# EAGLE design streams_v05 (EAGLE 7.7.0)

## Sheet 1 of 4
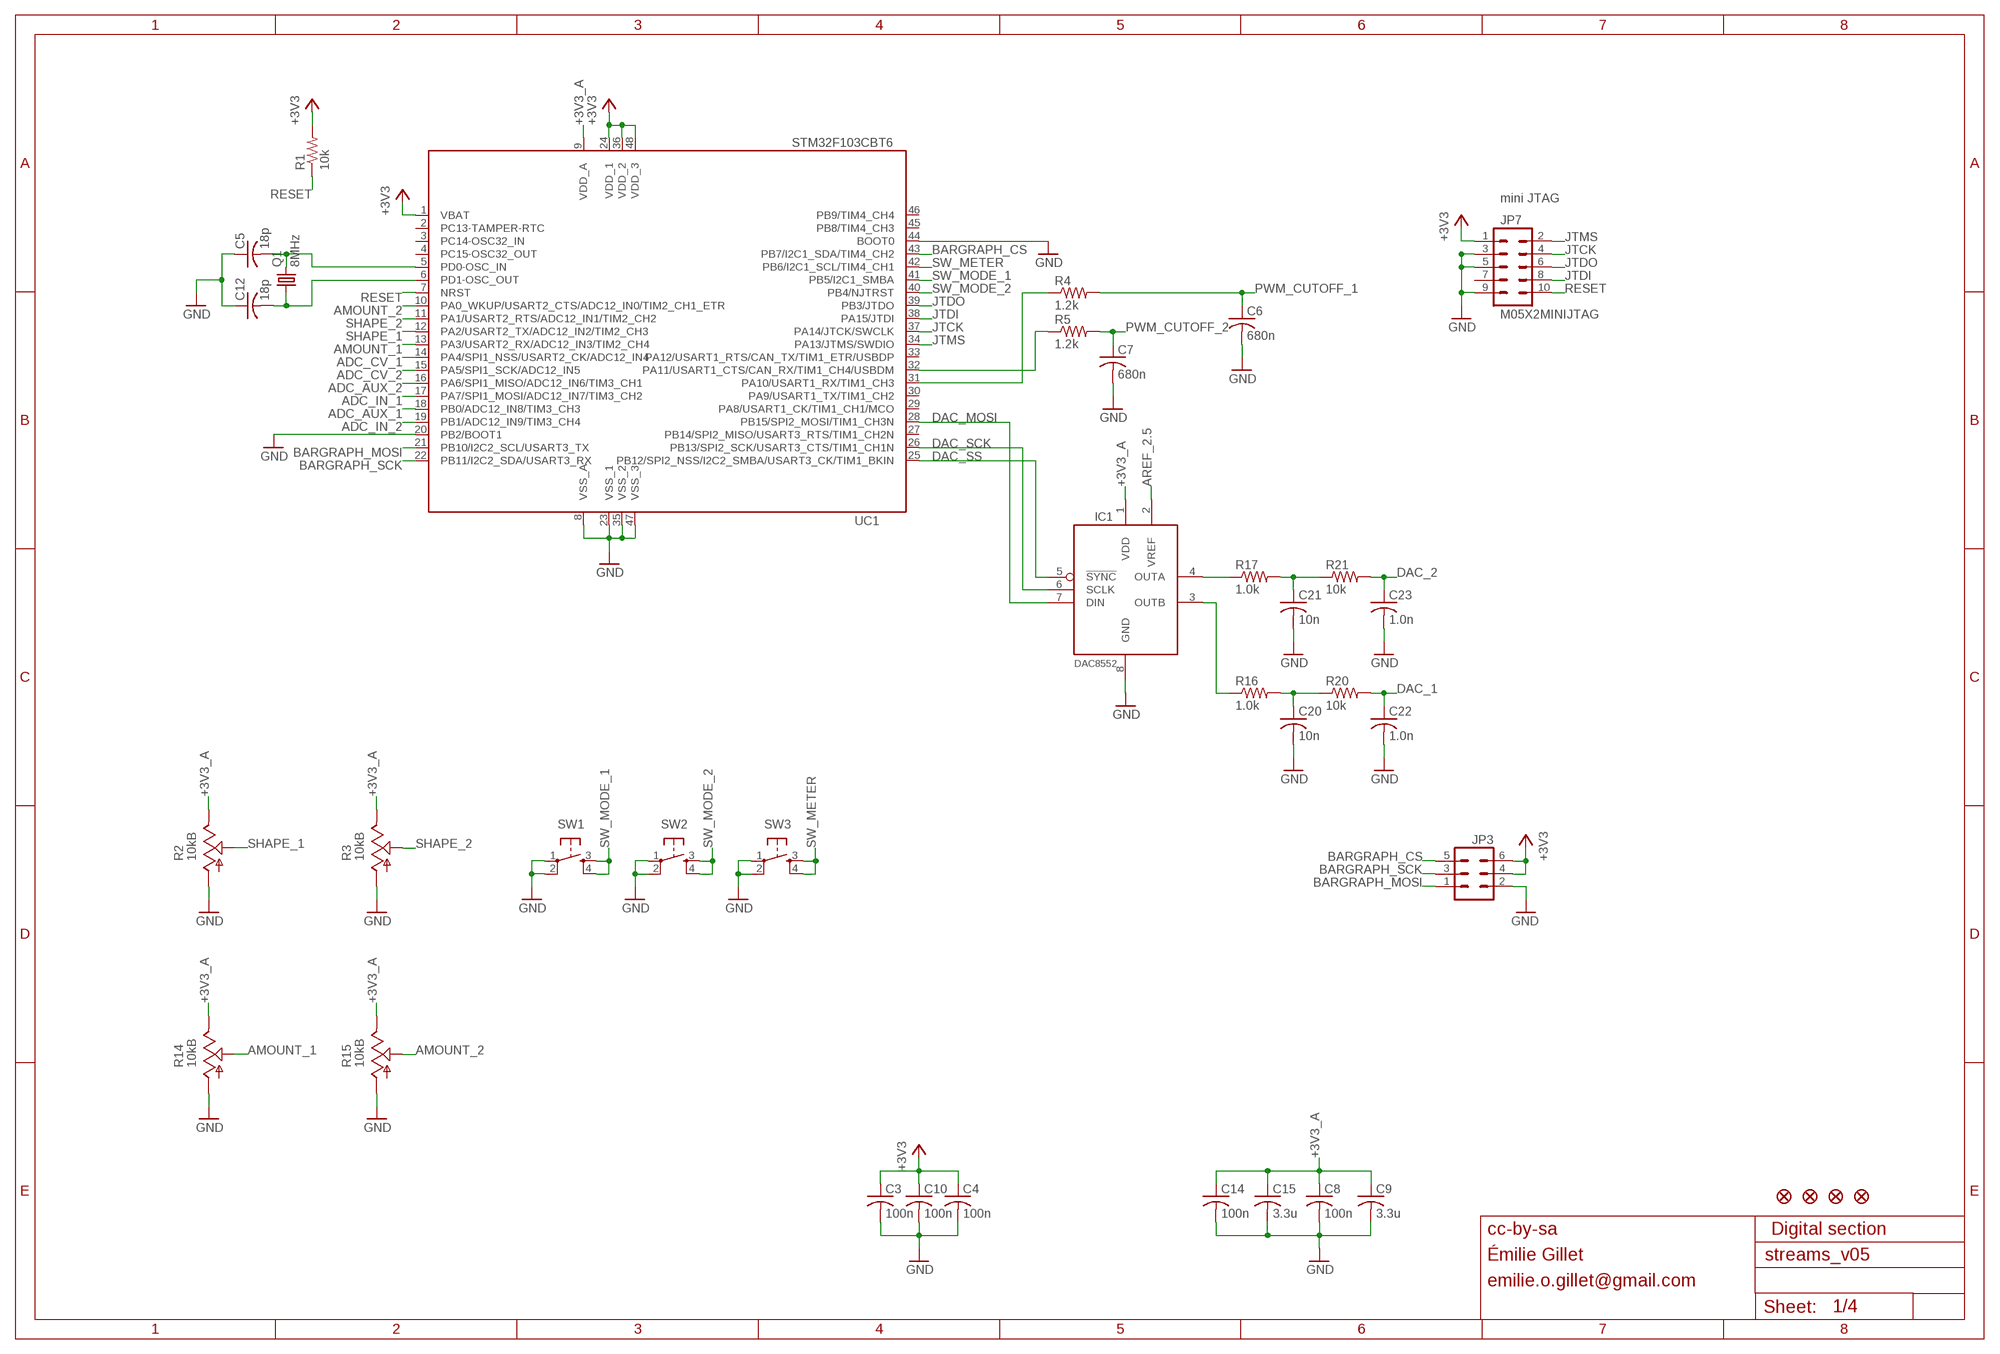
[diagram p0: schematic, sheet 1]

### Parts
C3  100n  C-USC0603  [C0603]
C4  100n  C-USC0603  [C0603]
C5  18p  C-USC0603  [C0603]
C6  680n  C-USC0603  [C0603]
C7  680n  C-USC0603  [C0603]
C8  100n  C-USC0603  [C0603]
C9  3.3u  C-USC0603  [C0603]
C10  100n  C-USC0603  [C0603]
C12  18p  C-USC0603  [C0603]
C14  100n  C-USC0603  [C0603]
C15  3.3u  C-USC0603  [C0603]
C20  10n  C-USC0603  [C0603]
C21  10n  C-USC0603  [C0603]
C22  1.0n  C-USC0603  [C0603]
C23  1.0n  C-USC0603  [C0603]
IC1  DAC8552  [MSOP-8]
JP1  FIDUCIAL1X2  [FIDUCIAL-1X2]
JP2  FIDUCIAL1X2  [FIDUCIAL-1X2]
JP3  M03X2BOTTOM  [2X3_BOTTOM]
JP4  FIDUCIAL1X2  [FIDUCIAL-1X2]
JP5  FIDUCIAL1X2  [FIDUCIAL-1X2]
JP7  M05X2MINIJTAG  [2X5-1.27]
Q1  8MHz  CRYSTALHC49UP  [HC49UP]
R1  10k  R-US_R0603  [R0603]
R2  10kB  POT_USVERTICAL_PS  [ALPS_POT_VERTICAL_PS]
R3  10kB  POT_USVERTICAL_PS  [ALPS_POT_VERTICAL_PS]
R4  1.2k  R-US_R0603  [R0603]
R5  1.2k  R-US_R0603  [R0603]
R14  10kB  POT_USVERTICAL_PS  [ALPS_POT_VERTICAL_PS]
R15  10kB  POT_USVERTICAL_PS  [ALPS_POT_VERTICAL_PS]
R16  1.0k  R-US_R0603  [R0603]
R17  1.0k  R-US_R0603  [R0603]
R20  10k  R-US_R0603  [R0603]
R21  10k  R-US_R0603  [R0603]
SW1  TAC_SWITCHPTH  [TACTILE-PTH]
SW2  TAC_SWITCHPTH  [TACTILE-PTH]
SW3  TAC_SWITCHPTH  [TACTILE-PTH]
UC1  STM32F103CBT6  STM32F103CB  [LQFP48]

### Nets
+3V3: C3.1 C4.1 C10.1 JP3.4 JP3.6 JP7.1 R1.2 UC1.1(VBAT) UC1.24(VDD_1) UC1.36(VDD_2) UC1.48(VDD_3) ; also sheet 4
+3V3_A: C8.1 C9.1 C14.1 C15.1 IC1.1(VDD) R2.P$1(E) R3.P$1(E) R14.P$1(E) R15.P$1(E) UC1.9(VDD_A) ; also sheet 2,3,4
ADC_AUX_1: UC1.18(PB0/ADC12_IN8/TIM3_CH3) ; also sheet 2
ADC_AUX_2: UC1.16(PA6/SPI1_MISO/ADC12_IN6/TIM3_CH1) ; also sheet 3
ADC_CV_1: UC1.14(PA4/SPI1_NSS/USART2_CK/ADC12_IN4) ; also sheet 2
ADC_CV_2: UC1.15(PA5/SPI1_SCK/ADC12_IN5) ; also sheet 3
ADC_IN_1: UC1.17(PA7/SPI1_MOSI/ADC12_IN7/TIM3_CH2) ; also sheet 2
ADC_IN_2: UC1.19(PB1/ADC12_IN9/TIM3_CH4) ; also sheet 3
AMOUNT_1: R14.P$2(S) UC1.13(PA3/USART2_RX/ADC12_IN3/TIM2_CH4)
AMOUNT_2: R15.P$2(S) UC1.10(PA0_WKUP/USART2_CTS/ADC12_IN0/TIM2_CH1_ETR)
AREF_2.5: IC1.2(VREF) ; also sheet 4
BARGRAPH_CS: JP3.5 UC1.43(PB7/I2C1_SDA/TIM4_CH2)
BARGRAPH_MOSI: JP3.1 UC1.21(PB10/I2C2_SCL/USART3_TX)
BARGRAPH_SCK: JP3.3 UC1.22(PB11/I2C2_SDA/USART3_RX)
DAC_1: C22.1 R20.2 ; also sheet 2
DAC_2: C23.1 R21.2 ; also sheet 3
DAC_MOSI: IC1.7(DIN) UC1.28(PB15/SPI2_MOSI/TIM1_CH3N)
DAC_SCK: IC1.6(SCLK) UC1.26(PB13/SPI2_SCK/USART3_CTS/TIM1_CH1N)
DAC_SS: IC1.5(!SYNC) UC1.25(PB12/SPI2_NSS/I2C2_SMBA/USART3_CK/TIM1_BKIN)
GND: C3.2 C4.2 C5.1 C6.2 C7.2 C8.2 C9.2 C10.2 C12.1 C14.2 C15.2 C20.2 C21.2 C22.2 C23.2 IC1.8(GND) JP3.2 JP7.3 JP7.5 JP7.9 R2.P$3(A) R3.P$3(A) R14.P$3(A) R15.P$3(A) SW1.1 SW1.2 SW2.1 SW2.2 SW3.1 SW3.2 UC1.8(VSS_A) UC1.20(PB2/BOOT1) UC1.23(VSS_1) UC1.35(VSS_2) UC1.44(BOOT0) UC1.47(VSS_3) ; also sheet 2,3,4
JTCK: JP7.4 UC1.37(PA14/JTCK/SWCLK)
JTDI: JP7.8 UC1.38(PA15/JTDI)
JTDO: JP7.6 UC1.39(PB3/JTDO)
JTMS: JP7.2 UC1.34(PA13/JTMS/SWDIO)
N$7: C5.2 Q1.2 UC1.5(PD0-OSC_IN)
N$8: C12.2 Q1.1 UC1.6(PD1-OSC_OUT)
N$70: IC1.4(OUTA) R17.1
N$72: IC1.3(OUTB) R16.1
N$73: C21.1 R17.2 R21.1
N$74: C20.1 R16.2 R20.1
N$90: R5.1 UC1.32(PA11/USART1_CTS/CAN_RX/TIM1_CH4/USBDM)
N$93: R4.1 UC1.31(PA10/USART1_RX/TIM1_CH3)
PWM_CUTOFF_1: C6.1 R4.2 ; also sheet 2
PWM_CUTOFF_2: C7.1 R5.2 ; also sheet 3
RESET: JP7.10 R1.1 UC1.7(NRST)
SHAPE_1: R2.P$2(S) UC1.12(PA2/USART2_TX/ADC12_IN2/TIM2_CH3)
SHAPE_2: R3.P$2(S) UC1.11(PA1/USART2_RTS/ADC12_IN1/TIM2_CH2)
SW_METER: SW3.3 SW3.4 UC1.42(PB6/I2C1_SCL/TIM4_CH1)
SW_MODE_1: SW1.3 SW1.4 UC1.41(PB5/I2C1_SMBA)
SW_MODE_2: SW2.3 SW2.4 UC1.40(PB4/NJTRST)
Unconnected: JP7.7 UC1.2(PC13-TAMPER-RTC) UC1.3(PC14-OSC32_IN) UC1.4(PC15-OSC32_OUT) UC1.27(PB14/SPI2_MISO/USART3_RTS/TIM1_CH2N) UC1.29(PA8/USART1_CK/TIM1_CH1/MCO) UC1.30(PA9/USART1_TX/TIM1_CH2) UC1.33(PA12/USART1_RTS/CAN_TX/TIM1_ETR/USBDP) UC1.45(PB8/TIM4_CH3) UC1.46(PB9/TIM4_CH4)

### Notes on the sheet
- mini JTAG
- cc-by-sa | Digital section
- Émilie Gillet
- emilie.o.gillet@gmail.com

## Sheet 2 of 4
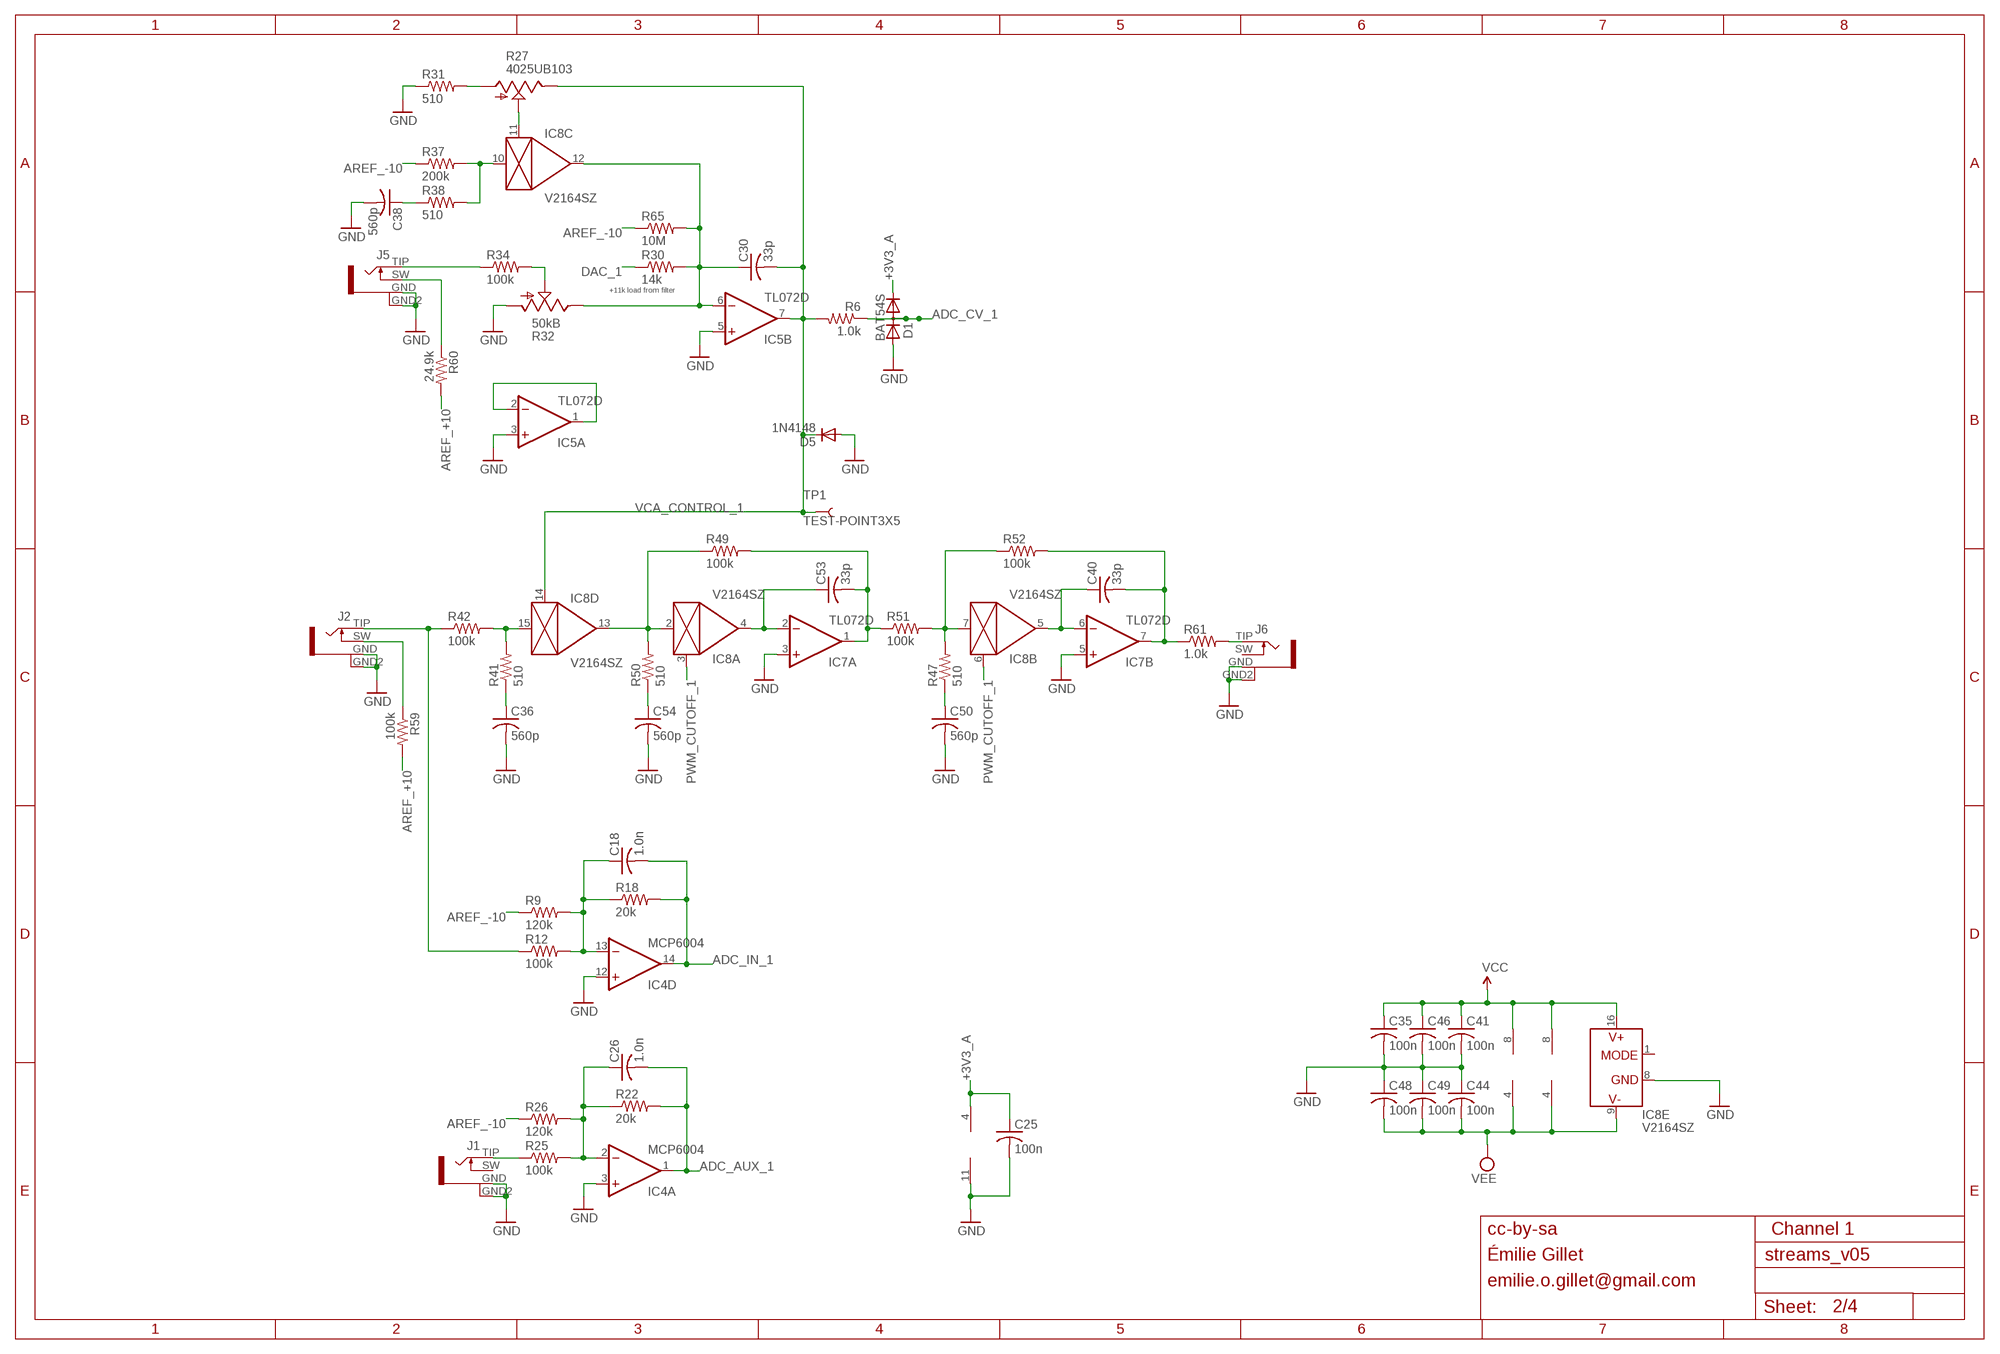
[diagram p1: schematic, sheet 2]

### Parts
C18  1.0n  C-USC0603  [C0603]
C25  100n  C-USC0603  [C0603]
C26  1.0n  C-USC0603  [C0603]
C30  33p  C-USC0603  [C0603]
C35  100n  C-USC0603  [C0603]
C36  560p  C-USC0603  [C0603]
C38  560p  C-USC0603  [C0603]
C40  33p  C-USC0603  [C0603]
C41  100n  C-USC0603  [C0603]
C44  100n  C-USC0603  [C0603]
C46  100n  C-USC0603  [C0603]
C48  100n  C-USC0603  [C0603]
C49  100n  C-USC0603  [C0603]
C50  560p  C-USC0603  [C0603]
C53  33p  C-USC0603  [C0603]
C54  560p  C-USC0603  [C0603]
D1  BAT54S  DIODE_2CACA-SOT23  [SOT23]
D5  1N4148  DIODE-SOD323-W  [SOD323-W]
IC4  MCP6004  TL074D  [SO14]
IC5  TL072D  [SO08]
IC7  TL072D  [SO08]
IC8  V2164SZ  SSM2164S  [SOIC16N]
J1  PJ301WQP  [WQP_PJ_301BM_WIDER]
J2  PJ301WQP  [WQP_PJ_301BM_WIDER]
J5  PJ301WQP  [WQP_PJ_301BM_WIDER]
J6  PJ301WQP  [WQP_PJ_301BM_WIDER]
R6  1.0k  R-US_R0603  [R0603]
R9  120k  R-US_R0603  [R0603]
R12  100k  R-US_R0603  [R0603]
R18  20k  R-US_R0603  [R0603]
R22  20k  R-US_R0603  [R0603]
R25  100k  R-US_R0603  [R0603]
R26  120k  R-US_R0603  [R0603]
R27  4025UB103  POT_USVERTICAL  [ALPS_POT_VERTICAL]
R30  14k  R-US_R0603  [R0603]
R31  510  R-US_R0603  [R0603]
R32  50kB  POT_USVERTICAL_PS  [ALPS_POT_VERTICAL_PS]
R34  100k  R-US_R0603  [R0603]
R37  200k  R-US_R0603  [R0603]
R38  510  R-US_R0603  [R0603]
R41  510  R-US_R0603  [R0603]
R42  100k  R-US_R0603  [R0603]
R47  510  R-US_R0603  [R0603]
R49  100k  R-US_R0603  [R0603]
R50  510  R-US_R0603  [R0603]
R51  100k  R-US_R0603  [R0603]
R52  100k  R-US_R0603  [R0603]
R59  100k  R-US_R0603  [R0603]
R60  24.9k  R-US_R0603  [R0603]
R61  1.0k  R-US_R0603  [R0603]
R65  10M  R-US_R0603  [R0603]
TP1  TEST-POINT3X5  [PAD.03X.05]

### Nets
+3V3_A: C25.1 D1.2(C) IC4.4(P:V+) ; also sheet 1,3,4
ADC_AUX_1: C26.2 IC4.1(A:OUT) R22.2 ; also sheet 1
ADC_CV_1: D1.3(AC) R6.1 ; also sheet 1
ADC_IN_1: C18.2 IC4.14(D:OUT) R18.2 ; also sheet 1
AREF_+5: J2.SW R59.1
AREF_+10: R59.2 R60.2 ; also sheet 3,4
AREF_-10: R9.1 R26.1 R37.1 R65.1 ; also sheet 3,4
DAC_1: R30.1 ; also sheet 1
FB_CURRENT1: IC8.10(C:IN) R37.2 R38.2
FB_CURRENT2: IC8.15(D:IN) R41.2 R42.2
GND: C25.2 C35.2 C36.2 C38.2 C41.2 C44.1 C46.2 C48.1 C49.1 C50.2 C54.2 D1.1(A) D5.A IC4.3(A:+IN) IC4.11(P:V-) IC4.12(D:+IN) IC5.3(A:+IN) IC5.5(B:+IN) IC7.3(A:+IN) IC7.5(B:+IN) IC8.8(E:GND) J1.GND J1.GND2 J2.GND J2.GND2 J5.GND J5.GND2 J6.GND J6.GND2 R31.1 R32.P$3(A) ; also sheet 1,3,4
IN_1: J2.TIP R12.1 R42.1
N$1: R27.P$3(A) R31.2
N$2: C30.1 IC5.6(B:-IN) IC8.12(C:OUT) R30.2 R32.P$1(E) R65.2
N$5: C38.1 R38.1
N$10: C36.1 R41.1
N$11: IC5.1(A:OUT) IC5.2(A:-IN)
N$12: J5.SW R60.1
N$13: J5.TIP R34.1
N$15: IC8.11(C:CTRL) R27.P$2(S)
N$23: R32.P$2(S) R34.2
N$26: C40.1 IC7.6(B:-IN) IC8.5(B:OUT)
N$27: C40.2 IC7.7(B:OUT) R52.2 R61.1
N$51: IC8.2(A:IN) IC8.13(D:OUT) R49.1 R50.2
N$65: J1.TIP R25.1
N$68: C18.1 IC4.13(D:-IN) R9.2 R12.2 R18.1
N$69: C26.1 IC4.2(A:-IN) R22.1 R25.2 R26.2
N$79: C53.1 IC7.2(A:-IN) IC8.4(A:OUT)
N$83: C53.2 IC7.1(A:OUT) R49.2 R51.1
N$84: IC8.7(B:IN) R47.2 R51.2 R52.1
N$85: C54.1 R50.1
N$86: C50.1 R47.1
N$87: J6.TIP R61.2
PWM_CUTOFF_1: IC8.3(A:CTRL) IC8.6(B:CTRL) ; also sheet 1
VCA_CONTROL_1: C30.2 D5.C IC5.7(B:OUT) IC8.14(D:CTRL) R6.2 R27.P$1(E) TP1.P$1
VCC: C35.1 C41.1 C46.1 IC5.8(P:V+) IC7.8(P:V+) IC8.16(E:V+) ; also sheet 3,4
VEE: C44.2 C48.2 C49.2 IC5.4(P:V-) IC7.4(P:V-) IC8.9(E:V-) ; also sheet 3,4
Unconnected: IC8.1(E:MODE) J1.SW J6.SW

### Notes on the sheet
- +11k load from filter
- cc-by-sa | Channel 1
- Émilie Gillet
- emilie.o.gillet@gmail.com

## Sheet 3 of 4
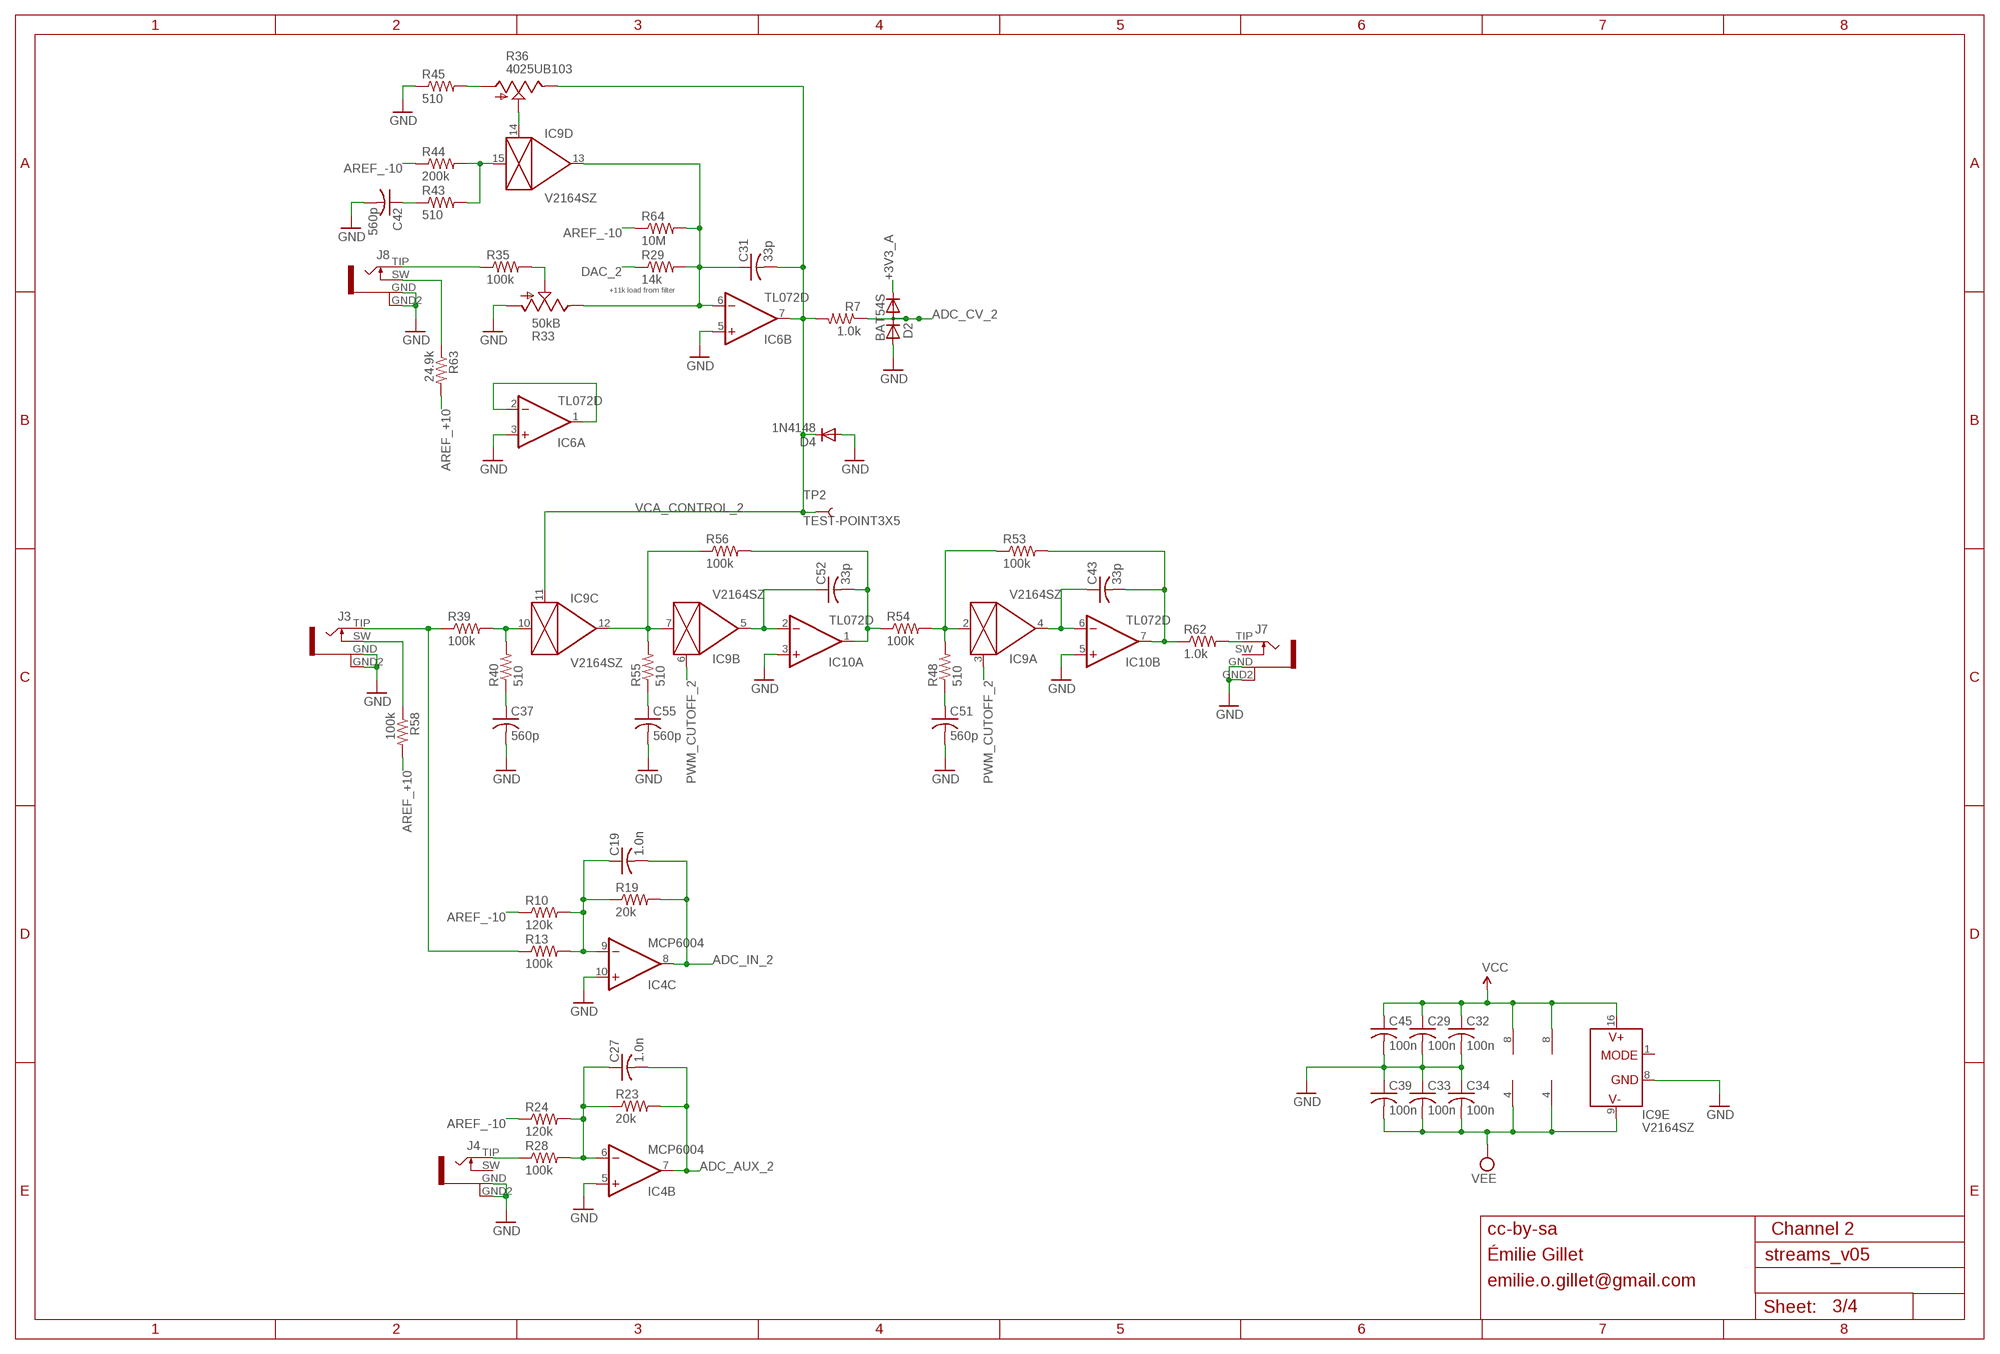
[diagram p2: schematic, sheet 3]

### Parts
C19  1.0n  C-USC0603  [C0603]
C27  1.0n  C-USC0603  [C0603]
C29  100n  C-USC0603  [C0603]
C31  33p  C-USC0603  [C0603]
C32  100n  C-USC0603  [C0603]
C33  100n  C-USC0603  [C0603]
C34  100n  C-USC0603  [C0603]
C37  560p  C-USC0603  [C0603]
C39  100n  C-USC0603  [C0603]
C42  560p  C-USC0603  [C0603]
C43  33p  C-USC0603  [C0603]
C45  100n  C-USC0603  [C0603]
C51  560p  C-USC0603  [C0603]
C52  33p  C-USC0603  [C0603]
C55  560p  C-USC0603  [C0603]
D2  BAT54S  DIODE_2CACA-SOT23  [SOT23]
D4  1N4148  DIODE-SOD323-W  [SOD323-W]
IC6  TL072D  [SO08]
IC9  V2164SZ  SSM2164S  [SOIC16N]
IC10  TL072D  [SO08]
J3  PJ301WQP  [WQP_PJ_301BM_WIDER]
J4  PJ301WQP  [WQP_PJ_301BM_WIDER]
J7  PJ301WQP  [WQP_PJ_301BM_WIDER]
J8  PJ301WQP  [WQP_PJ_301BM_WIDER]
R7  1.0k  R-US_R0603  [R0603]
R10  120k  R-US_R0603  [R0603]
R13  100k  R-US_R0603  [R0603]
R19  20k  R-US_R0603  [R0603]
R23  20k  R-US_R0603  [R0603]
R24  120k  R-US_R0603  [R0603]
R28  100k  R-US_R0603  [R0603]
R29  14k  R-US_R0603  [R0603]
R33  50kB  POT_USVERTICAL_PS  [ALPS_POT_VERTICAL_PS]
R35  100k  R-US_R0603  [R0603]
R36  4025UB103  POT_USVERTICAL  [ALPS_POT_VERTICAL]
R39  100k  R-US_R0603  [R0603]
R40  510  R-US_R0603  [R0603]
R43  510  R-US_R0603  [R0603]
R44  200k  R-US_R0603  [R0603]
R45  510  R-US_R0603  [R0603]
R48  510  R-US_R0603  [R0603]
R53  100k  R-US_R0603  [R0603]
R54  100k  R-US_R0603  [R0603]
R55  510  R-US_R0603  [R0603]
R56  100k  R-US_R0603  [R0603]
R58  100k  R-US_R0603  [R0603]
R62  1.0k  R-US_R0603  [R0603]
R63  24.9k  R-US_R0603  [R0603]
R64  10M  R-US_R0603  [R0603]
TP2  TEST-POINT3X5  [PAD.03X.05]

### Nets
+3V3_A: D2.2(C) ; also sheet 1,2,4
ADC_AUX_2: C27.2 IC4.7(B:OUT) R23.2 ; also sheet 1
ADC_CV_2: D2.3(AC) R7.1 ; also sheet 1
ADC_IN_2: C19.2 IC4.8(C:OUT) R19.2 ; also sheet 1
AREF_+10: R58.2 R63.2 ; also sheet 2,4
AREF_-10: R10.1 R24.1 R44.1 R64.1 ; also sheet 2,4
DAC_2: R29.1 ; also sheet 1
FB_CURRENT3: IC9.10(C:IN) R39.2 R40.2
FB_CURRENT4: IC9.15(D:IN) R43.2 R44.2
GND: C29.2 C32.2 C33.1 C34.1 C37.2 C39.1 C42.2 C45.2 C51.2 C55.2 D2.1(A) D4.A IC4.5(B:+IN) IC4.10(C:+IN) IC6.3(A:+IN) IC6.5(B:+IN) IC9.8(E:GND) IC10.3(A:+IN) IC10.5(B:+IN) J3.GND J3.GND2 J4.GND J4.GND2 J7.GND J7.GND2 J8.GND J8.GND2 R33.P$3(A) R45.1 ; also sheet 1,2,4
IN_2: J3.TIP R13.1 R39.1
N$3: J8.SW R63.1
N$4: C37.1 R40.1
N$9: C31.1 IC6.6(B:-IN) IC9.13(D:OUT) R29.2 R33.P$1(E) R64.2
N$14: C43.1 IC9.4(A:OUT) IC10.6(B:-IN)
N$16: C43.2 IC10.7(B:OUT) R53.2 R62.1
N$17: J7.TIP R62.2
N$18: R36.P$3(A) R45.2
N$19: C42.1 R43.1
N$24: R33.P$2(S) R35.2
N$25: J8.TIP R35.1
N$28: IC6.1(A:OUT) IC6.2(A:-IN)
N$29: IC9.14(D:CTRL) R36.P$2(S)
N$43: J3.SW R58.1
N$66: C27.1 IC4.6(B:-IN) R23.1 R24.2 R28.2
N$67: J4.TIP R28.1
N$71: C19.1 IC4.9(C:-IN) R10.2 R13.2 R19.1
N$75: IC9.7(B:IN) IC9.12(C:OUT) R55.2 R56.1
N$76: C52.1 IC9.5(B:OUT) IC10.2(A:-IN)
N$77: IC9.2(A:IN) R48.2 R53.1 R54.2
N$78: C52.2 IC10.1(A:OUT) R54.1 R56.2
N$81: C55.1 R55.1
N$82: C51.1 R48.1
PWM_CUTOFF_2: IC9.3(A:CTRL) IC9.6(B:CTRL) ; also sheet 1
VCA_CONTROL_2: C31.2 D4.C IC6.7(B:OUT) IC9.11(C:CTRL) R7.2 R36.P$1(E) TP2.P$1
VCC: C29.1 C32.1 C45.1 IC6.8(P:V+) IC9.16(E:V+) IC10.8(P:V+) ; also sheet 2,4
VEE: C33.2 C34.2 C39.2 IC6.4(P:V-) IC9.9(E:V-) IC10.4(P:V-) ; also sheet 2,4
Unconnected: IC9.1(E:MODE) J4.SW J7.SW

### Notes on the sheet
- +11k load from filter
- cc-by-sa | Channel 2
- Émilie Gillet
- emilie.o.gillet@gmail.com

## Sheet 4 of 4
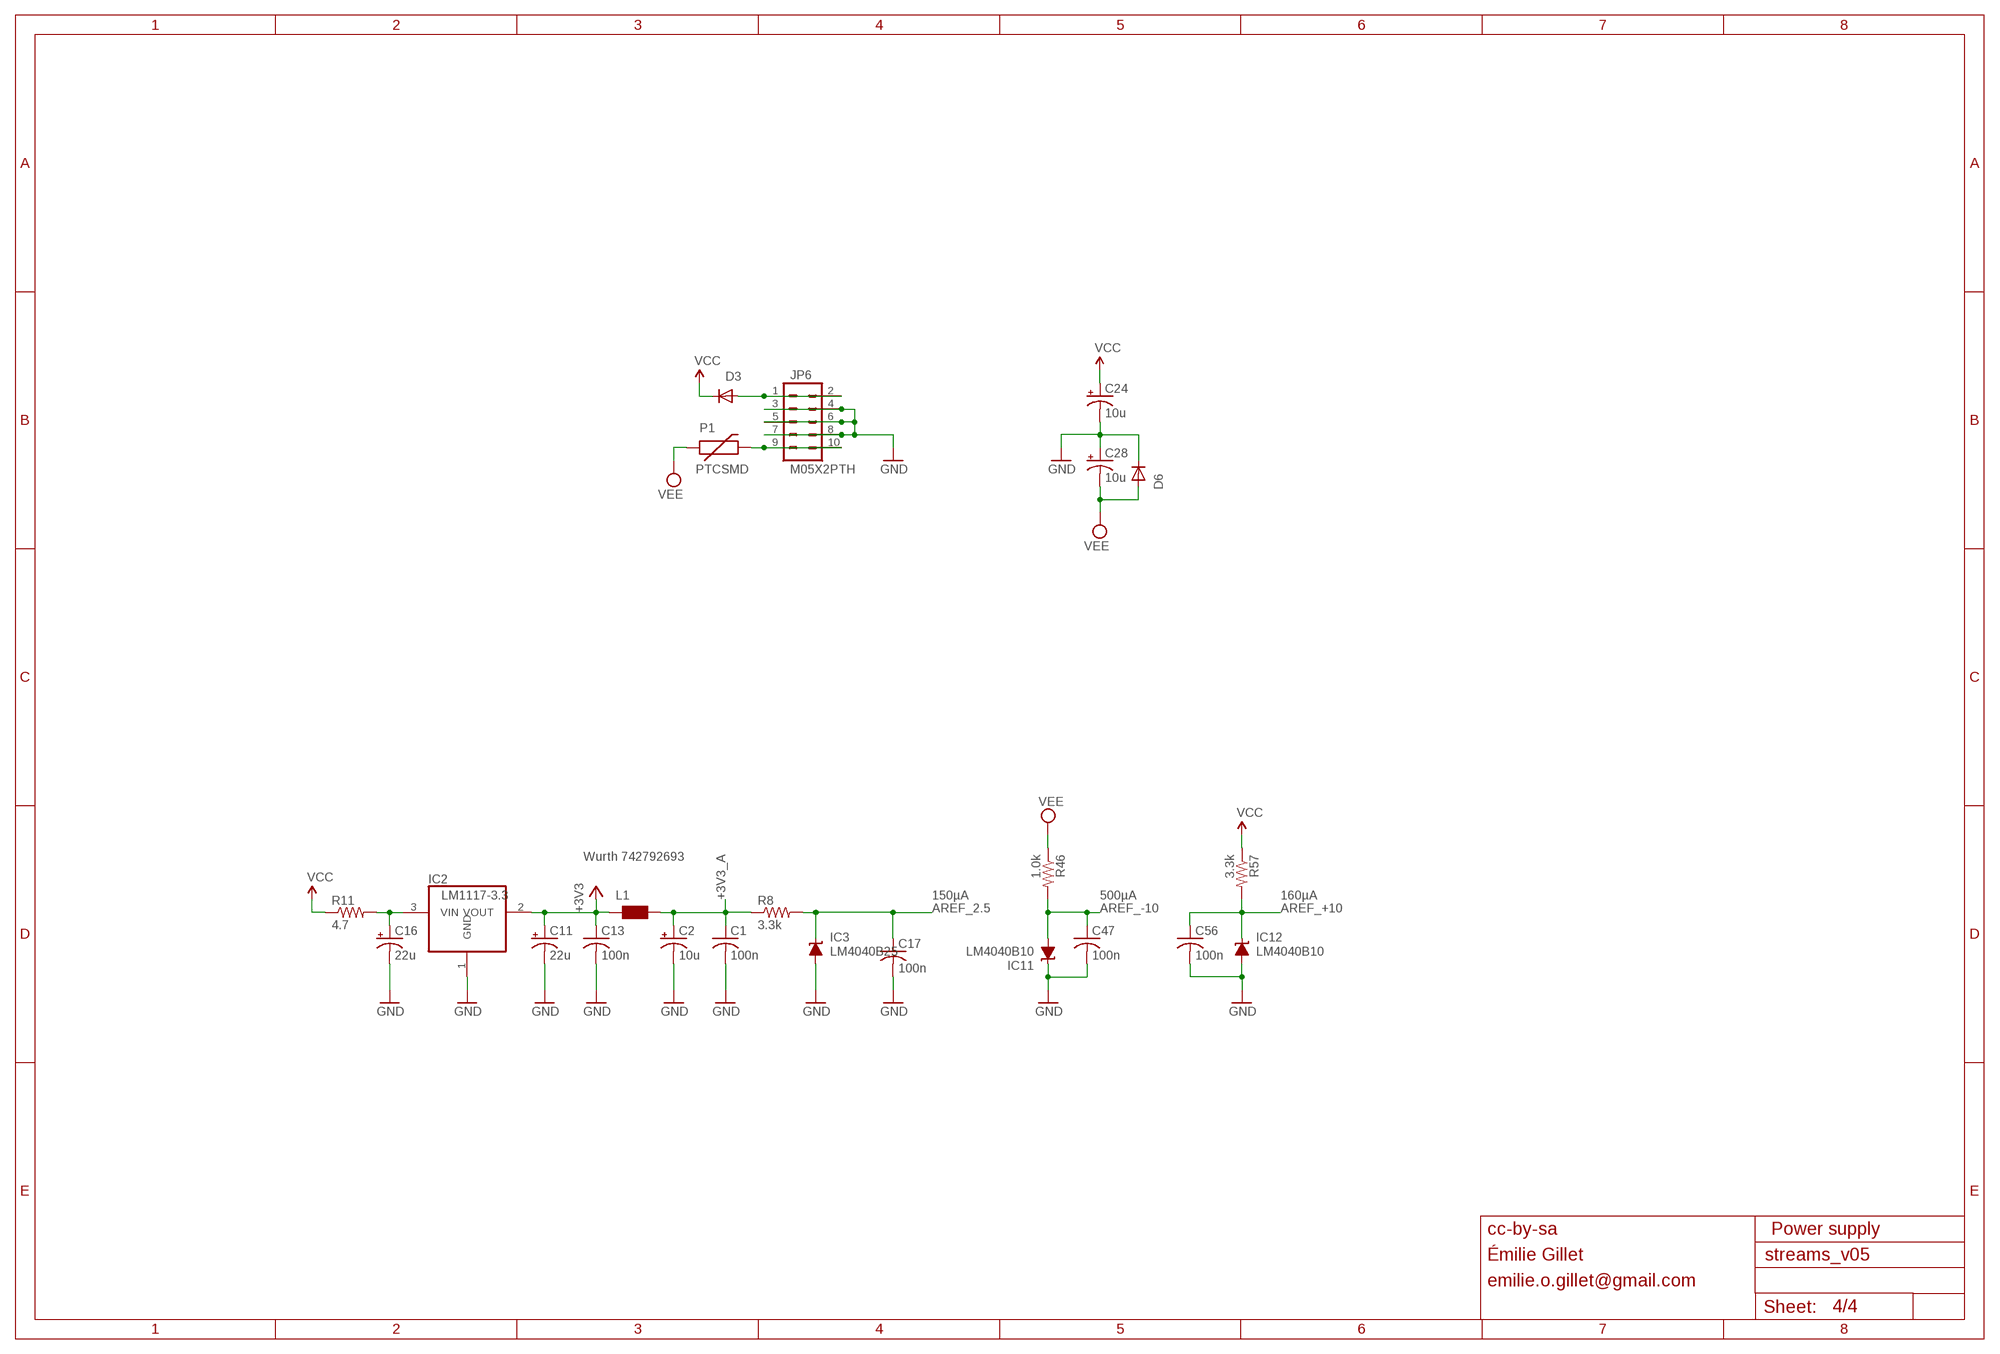
[diagram p3: schematic, sheet 4]

### Parts
C1  100n  C-USC0603  [C0603]
C2  10u  CPOL-USB  [PANASONIC_B]
C11  22u  CPOL-USB  [PANASONIC_B]
C13  100n  C-USC0603  [C0603]
C16  22u  CPOL-USC  [PANASONIC_C]
C17  100n  C-USC0603  [C0603]
C24  10u  CPOL-USB  [PANASONIC_B]
C28  10u  CPOL-USB  [PANASONIC_B]
C47  100n  C-USC0603  [C0603]
C56  100n  C-USC0603  [C0603]
D3  1N5819HW  DIODE-SOD123  [SOD123]
D6  1N5819HW  DIODE-SOD123  [SOD123]
IC2  LM1117-3.3  REG1117  [SOT223]
IC3  LM4040B25  LM4041B12DBZ  [DBZ_R-PDSO-G3]
IC11  LM4040B10  LM4041B12DBZ  [DBZ_R-PDSO-G3]
IC12  LM4040B10  LM4041B12DBZ  [DBZ_R-PDSO-G3]
JP6  M05X2PTH  [AVR_ICSP]
L1  WE-CBF_0603  [0603]
P1  PTCSMD  [PTC-1206]
R8  3.3k  R-US_R0603  [R0603]
R11  4.7  R-US_R1206  [R1206]
R46  1.0k  R-US_R0603  [R0603]
R57  3.3k  R-US_R0603  [R0603]

### Nets
+3V3: C11.+ C13.1 IC2.2(VOUT) L1.1 ; also sheet 1
+3V3_A: C1.1 C2.+ L1.2 R8.1 ; also sheet 1,2,3
AREF_2.5: C17.1 IC3.1(C) R8.2 ; also sheet 1
AREF_+10: C56.1 IC12.1(C) R57.2 ; also sheet 2,3
AREF_-10: C47.1 IC11.2(A) R46.2 ; also sheet 2,3
GND: C1.2 C2.- C11.- C13.2 C16.- C17.2 C24.- C28.+ C47.2 C56.2 D6.C IC2.1(GND) IC3.2(A) IC11.1(C) IC12.2(A) JP6.3 JP6.4 JP6.5 JP6.6 JP6.7 JP6.8 ; also sheet 1,2,3
N$21: C16.+ IC2.3(VIN) R11.2
N$56: D3.A JP6.1 JP6.2
N$64: JP6.9 JP6.10 P1.2
VCC: C24.+ D3.C R11.1 R57.1 ; also sheet 2,3
VEE: C28.- D6.A P1.1 R46.1 ; also sheet 2,3

### Notes on the sheet
- Wurth 742792693
- 150µA | 500µA | 160µA
- cc-by-sa | Power supply
- Émilie Gillet
- emilie.o.gillet@gmail.com

## Library data of the parts
C1 C3-C10 C12-C15 C17-C23 C25-C27 C29-C56 = rcl:C-US: CAPACITOR, American symbol
C2 C11 C16 C24 C28 = rcl:CPOL-US: POLARIZED CAPACITOR, American symbol
D1 D2 = diode:DIODE_2CACA-: 2 Diodes - Cathode-Anode|Cathode-Anode
D3-D6 = diode:DIODE-: DIODE
IC1 = og-dac:DAC8552
IC2 = og-vreg:REG1117: 800mA and 1A Low Dropout (LDO) Positive Regulator 1.8V, 2.5V, 2.85V, 3.3V, 5V, and Adj
IC3 IC11 IC12 = texas:LM4041: PRECISION MICROPOWER SHUNT VOLTAGE REFERENCE Source: http://focus.ti.com/lit/ds/slcs146e/slcs146e.pdf
IC4 = gm-ics:TL074: OP AMP
IC5-IC7 IC10 = og-linear:TL072: OP AMP
IC8 IC9 = ssm2164:SSM2164
J1-J8 = og-pj301:PJ301
JP1 JP2 JP4 JP5 = SparkFun:FIDUCIAL: Fiducial Alignment Points Various fiducial points for machine vision alignment.
JP3 = og-header:M03X2: PIN HEADER
JP6 JP7 = og-header:M05X2: Header 5x2 Standard 10-pin dual row 0.1" header. Commonly used with AVR-ISP. Use with Spark Fun Electronics SKU: PRT-00778
L1 = wuerth-elektronik:WE-CBF: SMD EMI Suppression Ferrite Beads - excellent anti-EMI properties - low DCR - impedances till 3000 ohms - rated current up to 6 A
P1 = SparkFun:PTC: Resettable Fuse PTC Resettable Fuse. Spark Fun Electronics SKU : COM-08357
Q1 = crystal:CRYSTAL: CRYSTAL
R1 R4-R13 R16-R26 R28-R31 R34 R35 R37-R65 = rcl:R-US_: RESISTOR, American symbol
R2 R3 R14 R15 R27 R32 R33 R36 = pot-alps:POT_US
SW1-SW3 = SparkFun:TAC_SWITCH: Momentary Switch Button commonly used for reset or general input. Spark Fun Electronics SKU : COM-00097
TP1 TP2 = SparkFun:TEST-POINT
UC1 = stm32:STM32F103CB

## Board
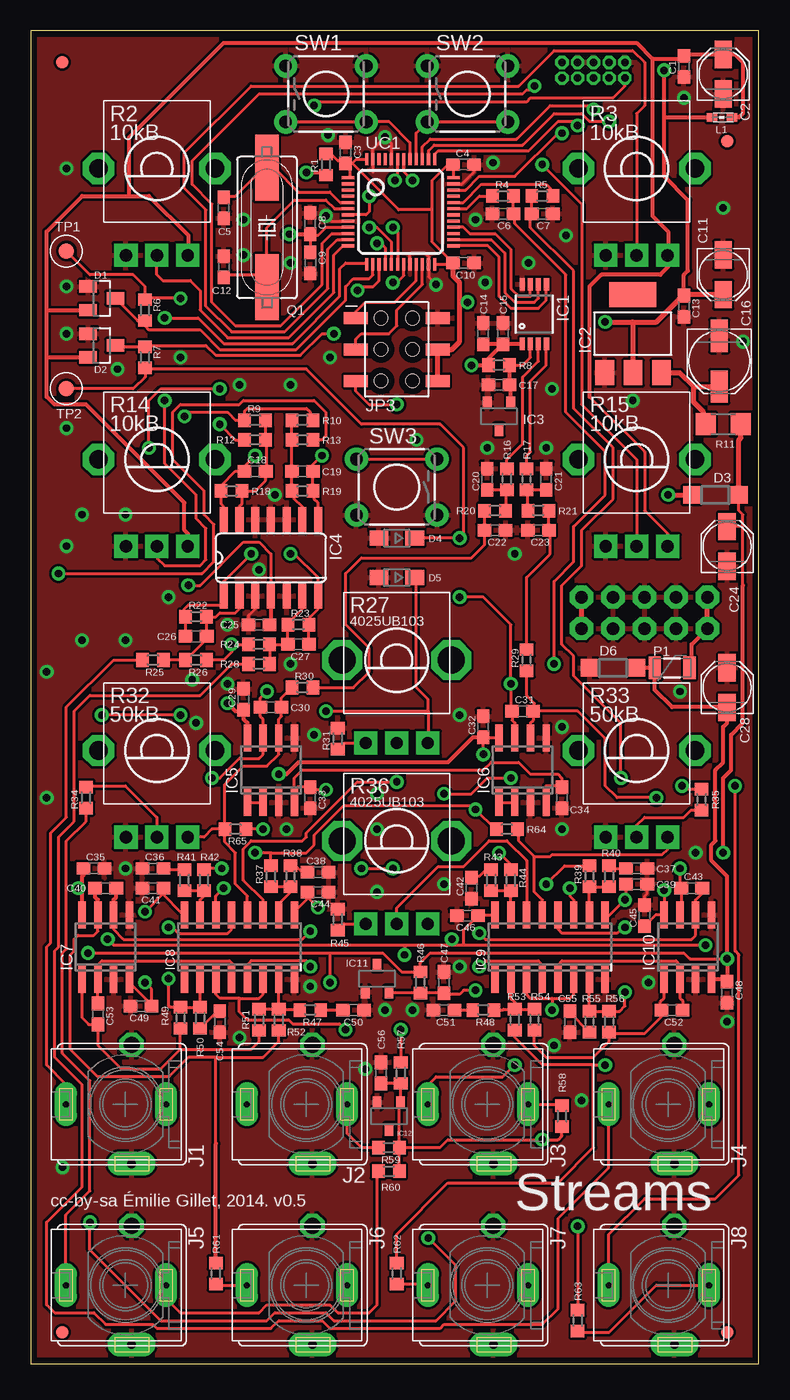
[diagram p4: board, top side]
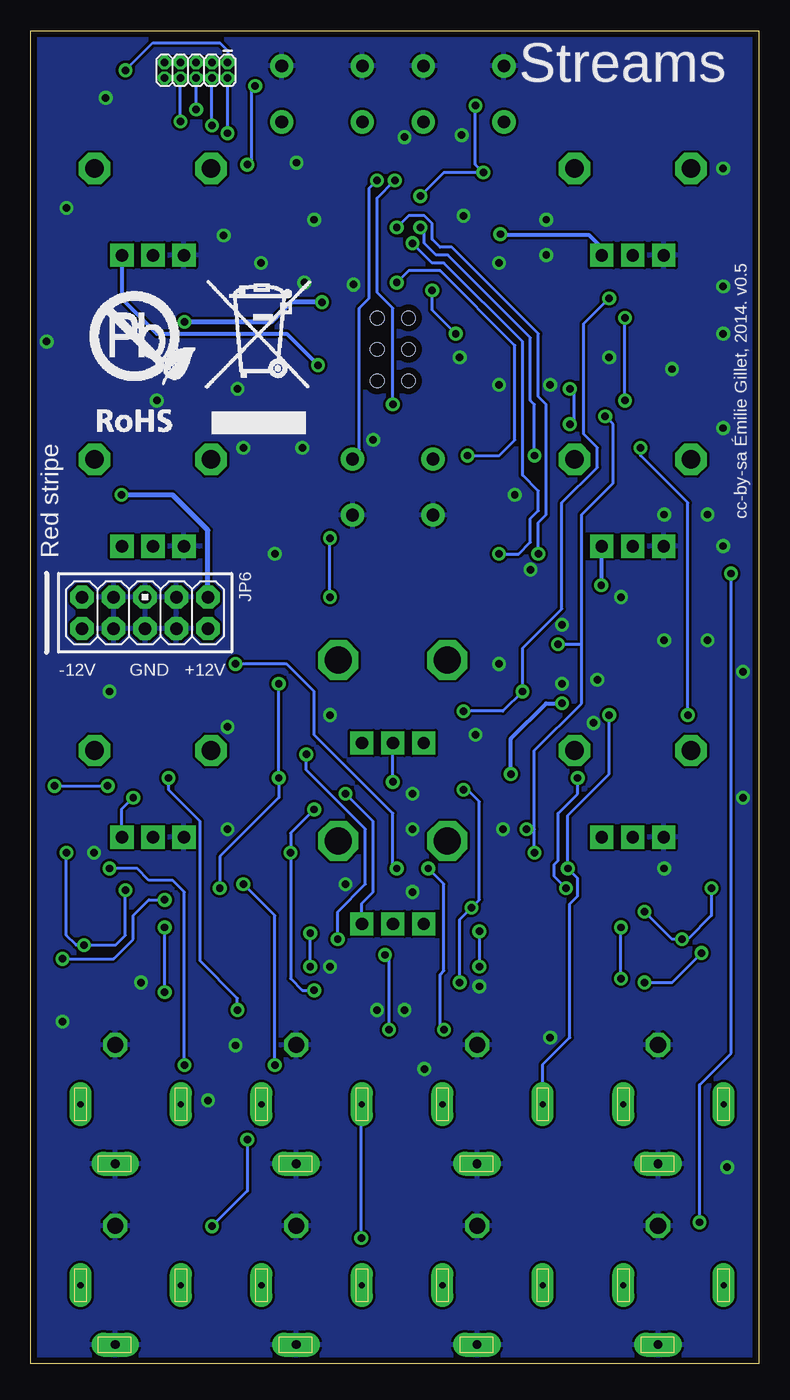
[diagram p5: board, bottom side, seen from below]

Size 58.74 x 107.63 mm. Coordinates in mm from the lower left corner, seen from the top.
Outline: 0,0 58.74,0 58.74,107.63 0,107.63 0,0
Copper layers (1*16): Top 0.035mm / dielectric 1.5mm / Bottom 0.035mm
Design rules "PCBCart-Standard": minimum track width 8mil, minimum drill 0.4mm, track to track 8mil, track to pad 8mil, pad to pad 8mil, via to via 8mil, smd to smd 8mil, copper to edge 20mil, drill to drill 8mil, minimum pad ring 8mil, minimum via ring 10mil, stop-mask expansion 3mil, vias tented up to drill 25mil, thermal gap 8mil

### Footprints (pad centres in the part's own frame; a part is rotated, then mirrored left to right if it is on the bottom)
C0603 = smd 1.1 x 1: 1 -0.85,0; 2 0.85,0
PANASONIC_B = smd 2.2 x 1.4: + 1.6,0; - -1.6,0
PANASONIC_C = smd 2.6 x 1.4: + 2.05,0; - -2.05,0
SOT23 = smd 1 x 1.4: 1 -0.95,-1.1; 2 0.95,-1.1; 3 0,1.1
SOD123 = smd 1.4 x 1.4: A 1.9,0; C -1.9,0
SOD323-W = smd 1.5 x 1.2: A 1.45,0; C -1.45,0
MSOP-8 = smd 0.41 x 1.02: 1 -0.975,-2.4; 2 -0.325,-2.4; 3 0.325,-2.4; 4 0.975,-2.4; 5 0.975,2.4; 6 0.325,2.4; 7 -0.325,2.4; 8 -0.975,2.4
SOT223 = smd 1.499 x 2.007: 1 -2.261,-3.15; 2 0.025,-3.15; 3 2.311,-3.15 | smd 3.81 x 2.007: 4 0,3.15
DBZ_R-PDSO-G3 = smd 0.7 x 1: 1 -0.95,-1.1; 2 0.95,-1.1; 3 0,1.1
SO14 = smd 0.66 x 2.032: 1 -3.81,-3.073; 2 -2.54,-3.073; 3 -1.27,-3.073; 4 0,-3.073; 5 1.27,-3.073; 6 2.54,-3.073; 7 3.81,-3.073; 8 3.81,3.073; 9 2.54,3.073; 10 1.27,3.073; 11 0,3.073; 12 -1.27,3.073; 13 -2.54,3.073; 14 -3.81,3.073
SO08 = smd 0.6 x 2.2: 1 -1.905,-2.6; 2 -0.635,-2.6; 3 0.635,-2.6; 4 1.905,-2.6; 5 1.905,2.6; 6 0.635,2.6; 7 -0.635,2.6; 8 -1.905,2.6
SOIC16N = smd 0.6 x 2.2: 1 -4.445,-2.6; 2 -3.175,-2.6; 3 -1.905,-2.6; 4 -0.635,-2.6; 5 0.635,-2.6; 6 1.905,-2.6; 7 3.175,-2.6; 8 4.445,-2.6; 9 4.445,2.6; 10 3.175,2.6; 11 1.905,2.6; 12 0.635,2.6; 13 -0.635,2.6; 14 -1.905,2.6; 15 -3.175,2.6; 16 -4.445,2.6
WQP_PJ_301BM_WIDER = drill 0.7 pad 1.93 long: GND -4.8,-0.5 | drill 1.3 octagon: GND2 4.8,-0.5 | drill 0.5 pad 1.778 long: SW 0,-3.3; TIP 0,4.8
FIDUCIAL-1X2 = smd 1 x 1: 1 0,0
2X3_BOTTOM = smd 0.965 x 1.93: 1 -2.54,-3.3; 2 -2.54,3.3; 3 0,-3.3; 4 0,3.3; 5 2.54,-3.3; 6 2.54,3.3 | hole 1.1: -2.54,1.27; 0,1.27; 2.54,1.27; 2.54,-1.27; 0,-1.27; -2.54,-1.27
AVR_ICSP = drill 1.016 pad 1.88 octagon: 1 -1.27,5.08; 2 1.27,5.08; 3 -1.27,2.54; 4 1.27,2.54; 5 -1.27,0; 6 1.27,0; 7 -1.27,-2.54; 8 1.27,-2.54; 9 -1.27,-5.08; 10 1.27,-5.08
2X5-1.27 = drill 0.61 pad 1.067 octagon: 1 -1.27,3.81; 2 0,3.81; 3 -1.27,2.54; 4 0,2.54; 5 -1.27,1.27; 6 0,1.27; 7 -1.27,0; 8 0,0; 9 -1.27,-1.27; 10 0,-1.27
0603 = smd 0.85 x 0.7: 1 -0.9,0; 2 0.7,0
PTC-1206 = smd 1 x 1.8: 1 -1.4,0; 2 1.4,0
HC49UP = smd 5.334 x 1.93: 1 -4.826,0; 2 4.826,0
R0603 = smd 1 x 1.1: 1 -0.85,0; 2 0.85,0
ALPS_POT_VERTICAL_PS = drill 1 pad 1.88 square: P$1 -2.5,7; P$2 0,7; P$3 2.5,7 | drill 1.5 pad 2.54 octagon: P$4 -4.7,0; P$5 4.7,0
R1206 = smd 1.6 x 1.803: 1 -1.422,0; 2 1.422,0
ALPS_POT_VERTICAL = drill 1 pad 1.88 square: P$1 -2.5,6.7; P$2 0,6.7; P$3 2.5,6.7 | drill 2.2 pad 3.175 octagon: P$4 -4.4,0; P$5 4.4,0
TACTILE-PTH = drill 1.016 pad 1.88 round: 1 -3.251,2.261; 2 3.251,2.261; 3 -3.251,-2.261; 4 3.251,-2.261
PAD.03X.05 = smd 1.27 x 1.27: P$1 0,0
LQFP48 = smd 0.254 x 1: 1 -2.75,-4.25; 2 -2.25,-4.25; 3 -1.75,-4.25; 4 -1.25,-4.25; 5 -0.75,-4.25; 6 -0.25,-4.25; 7 0.25,-4.25; 8 0.75,-4.25; 9 1.25,-4.25; 10 1.75,-4.25; 11 2.25,-4.25; 12 2.75,-4.25; 25 2.75,4.25; 26 2.25,4.25; 27 1.75,4.25; 28 1.25,4.25; 29 0.75,4.25; 30 0.25,4.25; 31 -0.25,4.25; 32 -0.75,4.25; 33 -1.25,4.25; 34 -1.75,4.25; 35 -2.25,4.25; 36 -2.75,4.25 | smd 1 x 0.254: 13 4.25,-2.75; 14 4.25,-2.25; 15 4.25,-1.75; 16 4.25,-1.25; 17 4.25,-0.75; 18 4.25,-0.25; 19 4.25,0.25; 20 4.25,0.75; 21 4.25,1.25; 22 4.25,1.75; 23 4.25,2.25; 24 4.25,2.75; 37 -4.25,2.75; 38 -4.25,2.25; 39 -4.25,1.75; 40 -4.25,1.25; 41 -4.25,0.75; 42 -4.25,0.25; 43 -4.25,-0.25; 44 -4.25,-0.75; 45 -4.25,-1.25; 46 -4.25,-1.75; 47 -4.25,-2.25; 48 -4.25,-2.75

### Placement (x,y rotation side)
C1  52.7,104.78 270 top
C2  55.88,104.14 90 top
C3  25.4,97.79 90 top
C4  34.92,96.84 0 top
C5  15.56,93.34 90 top
C6  38.1,92.87 180 top
C7  41.27,92.87 0 top
C8  22.54,92.08 90 top
C9  22.54,88.9 270 top
C10  34.92,88.9 0 top
C11  55.88,87.95 270 top
C12  15.56,88.58 270 top
C13  52.7,85.41 270 top
C14  36.51,83.19 90 top
C15  38.1,83.19 90 top
C16  55.56,80.96 270 top
C17  37.78,79.06 180 top
C18  18.1,72.07 180 top
C19  21.91,72.07 0 top
C20  36.83,71.44 90 top
C21  41.59,71.44 90 top
C22  37.47,67.31 0 top
C23  40.96,67.31 180 top
C24  56.2,66 90 top
C25  18.41,59.69 180 top
C26  13.34,58.74 180 top
C27  21.59,58.1 0 top
C28  56.2,54.61 90 top
C29  17.14,53.66 90 top
C30  19.37,53.02 180 top
C31  39.69,52.7 180 top
C32  36.51,51.44 90 top
C33  22.54,45.72 90 top
C34  42.86,45.72 90 top
C35  5.08,40.01 0 top
C36  9.84,40.01 180 top
C37  48.9,40.01 0 top
C38  23.18,39.69 0 top
C39  48.9,38.73 180 top
C40  6.03,38.42 180 top
C41  9.84,38.42 180 top
C42  35.56,38.42 270 top
C43  53.34,38.42 180 top
C44  23.18,38.1 180 top
C45  49.53,36.2 90 top
C46  35.24,36.2 180 top
C47  33.34,30.8 90 top
C48  56.2,30 90 top
C49  8.89,28.89 0 top
C50  26.04,28.57 0 top
C51  33.34,28.57 180 top
C52  51.75,28.57 180 top
C53  5.4,28.26 270 top
C54  15.24,27.62 270 top
C55  43.5,27.62 270 top
C56  28.26,23.5 90 top
D1  5.71,86.04 270 top
D2  5.71,82.23 270 top
D3  55.24,70.17 180 top
D4  29.53,66.67 180 top
D5  29.53,63.5 180 top
D6  46.99,56.2 0 top
IC1  40.64,84.77 0 top
IC2  48.58,83.19 0 top
IC3  37.78,76.52 180 top
IC4  19.37,65.09 0 top
IC5  19.37,47.94 0 top
IC6  39.69,47.94 0 top
IC7  6.03,33.66 0 top
IC8  16.83,33.66 0 top
IC9  41.91,33.66 0 top
IC10  53.02,33.66 0 top
IC11  27.94,31.11 0 top
IC12  28.89,20 180 top
J1  7.62,20.95 90 top
J2  22.23,20.95 90 top
J3  36.83,20.95 90 top
J4  51.44,20.95 90 top
J5  7.62,6.35 90 top
J6  22.23,6.35 90 top
J7  36.83,6.35 90 top
J8  51.44,6.35 90 top
JP1  2.54,105.09 0 top
JP2  56.2,98.74 0 top
JP3  29.53,81.92 270 top
JP4  2.54,2.54 0 top
JP5  56.2,2.54 0 top
JP6  49.53,60.64 270 bottom
JP7  46.67,103.82 270 bottom
L1  55.88,100.65 0 top
P1  51.75,56.2 0 top
Q1  19.05,91.76 90 top
R1  23.81,96.84 90 top
R2  10.16,96.52 180 top
R3  48.9,96.52 180 top
R4  38.1,94.3 0 top
R5  41.27,94.3 180 top
R6  9.21,85.09 90 top
R7  9.21,81.28 270 top
R8  37.78,80.64 0 top
R9  18.1,76.2 0 top
R10  21.91,76.2 180 top
R11  55.88,75.88 180 top
R12  18.1,74.61 0 top
R13  21.91,74.61 180 top
R14  10.16,73.03 180 top
R15  48.9,73.03 180 top
R16  38.42,71.44 270 top
R17  40.01,71.44 270 top
R18  16.19,70.48 180 top
R19  21.91,70.48 0 top
R20  37.47,68.9 180 top
R21  40.96,68.9 0 top
R22  13.34,60.33 180 top
R23  21.59,59.69 0 top
R24  18.41,58.1 0 top
R25  9.84,56.83 0 top
R26  13.34,56.83 180 top
R27  29.53,56.83 180 top
R28  18.41,56.52 0 top
R29  40.01,56.83 270 top
R30  21.91,54.61 180 top
R31  24.77,50.48 270 top
R32  10.16,49.53 180 top
R33  48.9,49.53 180 top
R34  4.45,45.72 90 top
R35  54.13,45.56 270 top
R36  29.53,42.23 180 top
R37  19.37,39.37 270 top
R38  20.95,39.37 270 top
R39  45.09,39.37 270 top
R40  46.67,39.37 270 top
R41  12.38,39.05 270 top
R42  13.97,39.05 270 top
R43  37.15,39.05 270 top
R44  38.73,39.05 270 top
R45  24.77,35.88 270 top
R46  31.43,30.8 270 top
R47  22.54,28.57 180 top
R48  36.51,28.57 0 top
R49  12.06,27.94 270 top
R50  13.65,27.94 90 top
R51  18.41,27.78 90 top
R52  20,27.78 270 top
R53  39.05,27.78 270 top
R54  40.64,27.78 90 top
R55  45.09,27.62 90 top
R56  46.67,27.62 270 top
R57  29.84,23.5 270 top
R58  42.86,20 270 top
R59  28.89,17.46 0 top
R60  28.89,15.56 0 top
R61  14.92,7.3 270 top
R62  29.53,7.3 270 top
R63  44.13,3.49 90 top
R64  38.42,43.18 0 top
R65  16.51,43.18 180 top
SW1  23.81,102.55 0 top
SW2  35.24,102.55 0 top
SW3  29.53,70.8 180 top
TP1  2.86,89.85 0 top
TP2  2.86,78.74 0 top
U$1  [ROHS_BIG]  55.24,74.3 0 bottom
UC1  29.84,93.03 270 top

### Tracks (layer width: path | path; a pad name or v marks a point on that pad's centre or on a via)
+3V3  (via drill 0.6)
  Top 0.254: UC1.24 33.95,88.78 C10.1 32.38,90.59 32.38,93.19 | 32.38,93.19 32.38,95.57 33.66,96.84 C4.1 34.08,95.8 UC1.36 | 25.93,96.94 C3.1 | UC1.1 25.72,95.9 25.72,96.52 25.4,96.84 C3.1 | 25.93,96.94 26.27,97.28 UC1.48 | C3.1 25.18,97.16 24.77,97.16 24.23,97.69 R1.2 | 25.93,96.94 29.69,93.19 32.38,93.19
  Top 0.305: 51.12,100.65 51.12,95.89 53.02,93.98 53.02,88.27 52.7,87.95 C13.1 | 51.12,100.65 v51.12,104.46 51.17,104.51 | 51.12,100.65 L1.1
  Top 0.406: C10.1 34.08,87.84 34.61,87.31 34.61,85.72 | JP3.6 JP3.4 33.97,81.92 34.61,82.55 34.61,85.72 | 34.61,85.72 v35.24,85.72 | v46.35,84.14 48.58,84.14 | 48.58,84.14 50.48,84.14 52.6,86.26 C13.1 52.81,86.36 C11.+ | IC2.2 48.58,80.06 48.58,84.14
  Bottom 0.254: v51.12,104.46 48.9,106.68 43.5,106.68 42.86,106.05 JP7.1
  Bottom 0.406: v35.24,85.72 37.78,85.72 39.37,84.14 v46.35,84.14
+3V3_A  (via drill 0.6)
  Top 0.254: 51.44,89.56 R3.P$1 51.44,89.48 | C9.1 C8.1 22.64,91.12 23.18,91.12 23.83,91.78 UC1.9 | 12.7,89.56 R2.P$1 | D1.2 | 4.45,81.11 D2.2 | 19.27,61.91 IC4.4 19.37,65.41 18.41,66.36 17.14,66.36 13.65,62.87 v12.7,62.87 | 45.09,78.11 49.53,73.66 49.53,68.9 51.4,67.03 R15.P$1
  Top 0.305: 51.44,89.56 51.44,91.44 50.16,92.71 50.16,105.41 | 50.16,105.41 48.9,106.68 15.56,106.68 7.94,99.06 7.94,94.3 | 51.44,89.48 51.44,88.58 50.8,87.95 46.04,87.95 45.09,87 45.09,78.11 | v20.85,91.22 C8.1 | 12.7,89.56 12.7,91.12 9.53,94.3 7.94,94.3 | 1.27,85.09 D1.2 | 50.16,105.41 52.49,105.41 C1.1 52.82,105.74 C2.+ 56.82,105.74 57.47,105.09 57.47,100.97 57.15,100.65 L1.2 | v35.56,80.64 R8.1 36.93,81.17 C15.1 | C15.1 C14.1 | C15.1 38.14,82.37 IC1.1 | C25.1 19.37,59.79 IC4.4 | R14.P$1 12.66,67.03 12.38,67.31 12.38,69.53 4.45,77.47 1.91,77.47 1.27,78.11 1.27,81.28 | 7.94,94.3 4.13,94.3 1.27,91.44 1.27,85.09 | 1.27,81.28 1.27,85.09 | 4.45,81.11 4.28,81.28 1.27,81.28
  Bottom 0.305: v35.56,80.64 38.1,83.19 48.58,83.19 51.4,86 R3.P$1 | R14.P$1 12.7,65.98 v12.7,62.87 | v20.85,91.22 20.75,91.12 13.65,91.12 12.66,90.13 R2.P$1
ADC_AUX_1  (via drill 0.6)
  Top 0.254: C26.2 R22.2 12.7,60.54 12.38,60.86 12.38,60.96 12.7,61.28 15.24,61.28 15.56,61.59 IC4.1 15.56,63.18 v17.78,65.41 | v29.21,91.76 29.59,91.37 UC1.18
  Bottom 0.254: v29.21,91.76 28.26,92.71 26.99,92.71 26.35,92.08 26.35,90.81 25.72,90.17 24.77,90.17 17.78,83.19 17.78,78.11 17.14,77.47 17.14,68.58 17.78,67.94 v17.78,65.41
ADC_AUX_2  (via drill 0.6)
  Top 0.254: C27.2 R23.2 22.54,59.79 22.54,60.33 23.18,60.96 IC4.7 23.18,63.5 21.27,65.41 v20.95,65.41 | v27.94,90.49 28.26,90.49 28.59,90.15 UC1.16
  Bottom 0.254: v27.94,90.49 26.35,88.9 25.4,88.9 19.05,82.55 19.05,71.75 17.78,70.48 17.78,68.9 18.41,68.26 18.41,66.36 19.37,65.41 v20.95,65.41
ADC_CV_1
  Top 0.254: UC1.14 27.59,87.92 27.3,87.63 26.04,87.63 25.4,87 25.4,85.88 21.43,81.92 15.24,81.92 13.65,83.5 9.53,83.5 9.21,83.82 R6.1 8.62,84.24 D1.3
ADC_CV_2  (via drill 0.6)
  Top 0.254: v24.45,83.19 23.5,83.19 21.75,81.44 14.92,81.44 14.13,82.23 9.31,82.23 R7.1 6.92,82.13 D2.3 | v26.35,86.68 26.67,87 27.62,87 28.09,87.47 UC1.15
  Bottom 0.254: v24.45,83.19 26.35,85.09 v26.35,86.68
ADC_IN_1  (via drill 0.6)
  Top 0.254: IC4.14 15.56,69.22 15.34,69.43 R18.2 15.34,70.91 16.51,72.07 C18.2 17.25,72.49 v18.1,73.34 | v27.3,91.76 27.94,91.76 29.09,90.6 UC1.17
  Bottom 0.254: v27.3,91.76 26.99,91.44 26.99,90.49 26.04,89.53 25.08,89.53 18.41,82.87 18.41,77.79 18.1,77.47 v18.1,73.34
ADC_IN_2  (via drill 0.6)
  Top 0.254: v29.21,87.31 29.53,87.31 30.09,87.88 UC1.19 | IC4.8 23.18,69.53 22.86,69.85 22.86,70.38 R19.2 C19.2 22.76,72.61 v23.5,73.34
  Bottom 0.254: v29.21,87.31 28.26,88.27 25.72,88.27 19.68,82.23 19.68,74.61 20.95,73.34 v23.5,73.34
AMOUNT_1  (via drill 0.6)
  Top 0.254: UC1.13 26.97,88.9 25.4,88.9 24.92,88.42 24.92,86.2 21.11,82.39 15.56,82.39 13.49,84.45 v10.79,84.45 | R14.P$2 10.16,65.09 10.79,64.45 13.65,64.45 14.13,64.93 14.13,67.47 13.34,68.26 13.34,70.17 10.79,72.71 v10.79,77.79
  Bottom 0.254: v10.79,77.79 v10.79,84.45
AMOUNT_2  (via drill 0.6)
  Top 0.254: R15.P$2 48.9,73.03 44.45,77.47 44.45,93.66 v41.27,96.84 | UC1.10 24.29,91.28 23.5,90.49 23.5,87.15 20.16,83.82 16.51,83.82 14.61,85.72 14.61,93.66 13.02,95.25 13.02,97.16 18.41,102.55 39.69,102.55 40.01,102.87 40.32,102.87 v40.64,103.19
  Bottom 0.254: v40.64,103.19 40.96,102.87 40.96,97.16 v41.27,96.84
AREF_2.5
  Top 0.254: IC1.2 40.31,81.27 39.69,80.64 R8.2
  Top 0.305: R8.2 C17.1 38.73,78.96 IC3.1
AREF_+5
  Top 0.254: R59.1 26.67,17.46 25.52,18.61 J2.SW
AREF_+10  (via drill 0.6)
  Top 0.254: R57.2 C56.1 | R57.2 IC12.1 29.74,21 R59.2 | R57.2 29.9,22.7 | R59.2 33.02,17.46 33.66,18.1 v41.27,18.1 42.55,18.1 42.86,18.41 R58.2 | R60.2 R59.2 | v44.13,11.11 R63.2
  Bottom 0.254: v44.13,11.11 41.27,13.97 v41.27,18.1
AREF_-10  (via drill 0.6)
  Top 0.254: R24.1 v16.19,58.1 16.19,57.47 15.56,56.83 R26.1 | 19.37,41.27 v18.1,41.27 | v12.38,76.52 12.7,76.83 15.88,76.83 16.51,76.2 R9.1 17.25,76.94 17.46,77.15 22.23,77.15 22.54,76.83 22.54,76.42 R10.1 | 38.84,39.9 R44.1 38.73,40.32 v37.78,41.27 | R37.1 19.37,41.27 | 19.37,41.27 22.23,41.27 22.86,41.91 22.86,42.7 25.24,45.09 35.56,45.09 v35.88,44.77 37.47,43.18 R64.1 | IC11.2 28.96,29.95 R46.2 C47.1 33.39,30 33.55,29.84 34.61,29.84 34.92,30.16 v35.88,30.16 | v18.73,43.18 R65.1
  Bottom 0.254: v18.1,41.27 18.1,43.18 | 18.1,43.18 18.1,49.53 14.29,53.34 14.29,58.1 | v35.88,44.77 37.78,42.86 v37.78,41.27 37.78,31.11 36.83,30.16 v35.88,30.16 | v12.38,76.52 11.75,75.88 11.75,71.12 14.29,68.58 14.29,58.1 | 14.29,58.1 v16.19,58.1 | 18.1,43.18 v18.73,43.18
BARGRAPH_CS  (via drill 0.6)
  Top 0.254: v29.53,77.47 27.3,77.47 26.23,78.55 JP3.5 | v29.37,95.57 29.59,95.79 UC1.43
  Bottom 0.254: v29.53,77.47 29.53,85.25 30.8,86.52 30.8,94.14 v29.37,95.57 29.21,95.57
BARGRAPH_MOSI
  Top 0.254: UC1.21 31.09,87.45 29.37,85.72 26.99,85.72 26.23,84.97 JP3.1
BARGRAPH_SCK
  Top 0.254: UC1.22 31.59,87.16 29.53,85.09 29.53,83.82 28.89,83.19 26.67,83.19 26.23,82.74 JP3.3
DAC_1
  Top 0.254: R20.2 C22.1 36.62,66.14 35.56,65.09 26.67,65.09 25.4,63.82 25.4,59.69 27.3,57.78 27.3,55.88 26.04,54.61 R30.1
DAC_2
  Top 0.254: R21.2 C23.1 41.91,67.21 41.91,65.41 40.01,63.5 R29.1
DAC_MOSI
  Top 0.254: IC1.7 40.32,87.17 40.32,86.2 39.37,86.2 38.73,86.84 38.73,90.01 37.47,91.28 35.4,91.28 34.91,91.78 UC1.28
DAC_SCK
  Top 0.254: IC1.6 40.96,87.17 40.96,86.04 40.64,85.72 39.05,85.72 38.26,86.52 38.26,89.69 37.17,90.78 UC1.26
DAC_SS
  Top 0.254: IC1.5 41.59,87.15 41.59,85.88 40.96,85.25 38.73,85.25 37.78,86.2 37.78,89.38 36.88,90.28 UC1.25
FB_CURRENT1
  Top 0.254: IC8.10 20,37.15 20.95,38.1 R38.2 R37.2
FB_CURRENT2
  Top 0.254: R41.2 R42.2 13.97,37.78 13.65,37.47 IC8.15
FB_CURRENT3
  Top 0.254: IC9.10 R39.2 R40.2
FB_CURRENT4
  Top 0.254: R43.2 R44.2 IC9.15
GND  (via drill 0.6)
  Top 0.254: 27.62,96.2 27.62,97.25 UC1.47 27.59,98.08 v28.57,99.06 29.09,98.54 UC1.44 | UC1.35 34.79,95.28 35.77,96.26 C4.2 | C8.2 22.64,93.03 | v23.81,92.71 24.25,92.28 UC1.8 | UC1.20 30.59,89.62 30.68,89.71 31.8,89.71 32.11,89.41 32.11,88.79 UC1.23 32.09,87.76 v32.7,87.15 | IC4.3 18.1,60.96 17.57,60.43 C25.2 | C45.2 | C45.2 49.53,37.78 49.74,38 C39.1
  other vias: 37.31,97 55.88,93.34 57.47,82.55 43.18,91.12 36.67,87.31 35.88,92.39 17.14,92.39 23.97,99.22 2.86,83.19 2.86,87 15.88,59.69 22.54,30.48 42.23,25.72 49.85,30.8 7.62,40.01 13.02,55.24 44.45,21.27 56.2,27.62 20.64,43.18 39.05,65.41 34.61,52.39 42.86,43.18 52.39,54.29 26.99,23.81 13.34,51.75 42.86,51.44 40.16,88.9 41.59,73.98 36.83,73.98 52.7,102.23 48.58,77.79 42.07,78.74 11.11,61.91 18.41,64.14 19.68,70.17 22.86,50.8 6.99,80.33 20.95,88.9 16.83,79.06 20.95,79.06 4.13,68.58 7.62,68.58 4.13,58.42 7.62,58.42 20.95,56.52 2.54,15.88 1.27,45.72 1.27,55.88 2.86,66.04 2.86,75.56 2.86,96.52 31.11,74.61 12.06,81.28 24.13,81.28 53.66,41.27 16.83,26.35 30.8,28.57 34.61,32.07 27.94,43.18 15.88,54.93 27.94,46.04 27.94,38.1 33.34,38.73 28.57,28.57 17.14,89.53
  pour Bottom: 0,107.63 0,0 58.74,0 58.74,107.63
  pour Top (isolate 0.203): 0,107.63 0,0 58.74,0 58.74,107.63
IN_1  (via drill 0.6)
  Top 0.254: R42.1 14.07,40.01 v15.4,40.01 | v15.24,75.88 16.51,74.61 R12.1 | v9.53,73.98 9.53,77.79 10.48,78.74 v15.24,78.74 | v12.06,52.39 v5.71,52.39
  Bottom 0.254: J2.TIP 17.43,24.17 15.24,26.35 15.24,37.15 14.61,37.78 14.61,39.21 v15.4,40.01 15.4,44.29 12.06,47.62 v12.06,52.39 | v15.24,78.74 14.92,78.42 14.92,76.2 v15.24,75.88 | v5.71,52.39 5.71,69.53 9.53,73.34 v9.53,73.98
IN_2  (via drill 0.6)
  Top 0.254: v39.05,24.13 38.1,23.18 32.7,23.18 32.03,22.5 J3.TIP | v32.07,10.16 34.29,7.94 34.29,5.08 32.7,3.49 24.45,3.49 23.81,4.13 19.68,4.13 19.05,3.49 10.48,3.49 4.76,9.21 v4.76,11.43 | v2.22,63.82 13.81,63.82 14.76,64.77 14.76,67.79 13.97,68.58 | R13.1 23.5,74.61 23.81,74.93 23.81,76.83 22.86,77.79 17.14,77.79 16.83,77.47 12.06,77.47 11.43,76.83 11.43,73.03 13.97,70.48 13.97,68.58 | v41.59,38.73 43.08,40.22 R39.1 | 13.97,68.58
  Bottom 0.254: v41.59,38.73 39.05,36.2 v39.05,24.13 | J3.TIP 32.07,20.92 v32.07,10.16 | v4.76,11.43 4.76,22.54 2.22,25.08 v2.22,63.82
JTCK  (via drill 0.6)
  Top 0.254: UC1.37 32.59,97.68 32.86,97.95 40.16,97.95 42.55,100.33 43.81,100.33 v44.13,100.01
  Bottom 0.254: v44.13,100.01 JP7.4
JTDI  (via drill 0.6)
  Top 0.254: UC1.38 32.09,97.98 32.54,98.42 39.69,98.42 42.23,100.97 44.45,100.97 45.09,100.33 v46.67,100.33
  Bottom 0.254: v46.67,100.33 JP7.8
JTDO  (via drill 0.6)
  Top 0.254: UC1.39 31.59,98.27 32.23,98.9 39.21,98.9 41.91,101.6 45.09,101.6 v45.4,101.28
  Bottom 0.254: v45.4,101.28 JP7.6
JTMS  (via drill 0.6)
  Top 0.254: UC1.34 35.09,94.78 36.2,95.89 39.05,95.89 42.55,99.38 v42.86,99.38
  Bottom 0.254: v42.86,99.38 JP7.2
N$1
  Top 0.254: R31.2 25.27,50.13 R27.P$3
N$2
  Top 0.254: C30.1 20.22,52.28 20,52.07 IC5.6 20,49.21 19.05,48.26 17.14,48.26 15.66,46.77 R65.2 | C30.1 20.11,53.13 | IC8.12 17.46,37.78 16.51,38.73 16.51,41.27 15.66,42.12 R65.2 | R30.2 20.22,53.77 C30.1 | R32.P$1 12.68,42.55 13.97,42.55 14.61,43.18 R65.2
N$3
  Top 0.254: R63.1 44.23,2.54 46.67,2.54 50.48,6.35 J8.SW
N$4
  Top 0.254: R40.1 46.77,40.32 47.09,40.01 C37.1
N$5
  Top 0.254: C38.1 21.91,39.69 21.38,40.22 R38.1
N$7
  Top 0.254: UC1.5 24.97,93.78 24.13,94.61 21.59,94.61 19.62,96.58 Q1.2 18.8,96.58 16.51,94.3 15.66,94.3 C5.2
N$8
  Top 0.254: UC1.6 24.52,93.28 23.81,93.98 21.27,93.98 19.05,91.76 19.05,87.95 | 19.05,87.95 Q1.1 | C12.2 15.77,87.95 19.05,87.95
N$9  (via drill 0.6)
  Top 0.254: IC6.6 40.32,51.75 40.54,51.97 C31.1 | C31.1 40.42,52.82 40.64,53.03 40.64,53.34 40.01,53.98 R29.2 | C31.1 44.13,52.7 46.35,50.48 46.35,46.67 47.31,45.72 v50.48,45.72 | IC9.13 41.27,37.47 40.64,38.1 40.64,40.96 | R33.P$1 51.44,42.49 51.44,41.59 50.96,41.12 42.07,41.12 | 42.07,41.12 | 42.07,41.12 41.91,40.96 40.64,40.96 | R64.2 39.37,43.08 39.37,42.23 40.64,40.96
  Bottom 0.254: v50.48,45.72 51.4,44.81 R33.P$1
N$10
  Top 0.254: C36.1 10.79,39.9 R41.1
N$11
  Top 0.254: IC5.1 IC5.2
N$12
  Top 0.254: R60.1 27.94,15.46 27.94,4.76 27.3,4.13 24.77,4.13 24.13,4.76 19.05,4.76 18.41,4.13 12.06,4.13 10.92,5.27 J5.SW
N$13
  Top 0.254: J5.TIP 2.82,12.03 4.76,13.97 4.76,22.86 2.54,25.08 2.54,33.18 2.86,33.5 2.86,42.23 4.45,43.81 R34.1
N$14  (via drill 0.6)
  Top 0.254: C43.1 54.19,38 53.66,37.47 IC10.6 53.66,34.61 53.34,34.29 36.67,34.29 v36.2,34.77 | IC9.4 41.27,32.23 40.96,32.54 36.67,32.54 v36.2,32.07
  Bottom 0.254: v36.2,32.07 v36.2,34.77
N$15  (via drill 0.6)
  Top 0.254: v29.53,46.99 26.35,46.99 22.23,42.86 22.23,42.55 21.91,42.23 17.78,42.23 17.14,41.59 17.14,39.05 18.73,37.47 IC8.11
  Bottom 0.254: v29.53,46.99 R27.P$2
N$16  (via drill 0.6)
  Top 0.254: IC10.7 52.49,36.36 C43.2 52.39,38.52 v52.39,40.01 | 45.4,24.13 41.27,24.13 39.05,26.35 R53.2 | R62.1 29.53,10.48 33.66,14.61 42.55,14.61 45.4,17.46 45.4,24.13 | 45.4,24.13 v46.35,24.13
  Bottom 0.254: v52.39,40.01 50.16,40.01 49.21,39.05 47.31,39.05 46.35,38.1 v46.35,24.13
N$17
  Top 0.254: J7.TIP 31.93,6.45 R62.2
N$18
  Top 0.254: R45.2 25.27,35.53 R36.P$3
N$19
  Top 0.254: C42.1 35.66,39.37 36.2,39.37 36.73,39.9 R43.1
N$21
  Top 0.406: IC2.3 50.91,80.01 52.39,80.01 53.48,78.91 | 53.48,78.91 C16.+ | R11.2 54.29,76.05 54.29,76.83 53.48,77.64 53.48,78.91
N$23
  Top 0.254: R34.2 4.55,46.67 7.62,46.67 10.16,44.13 R32.P$2
N$24
  Top 0.254: R33.P$2 48.9,43.5 49.53,44.13 52.7,44.13 53.28,44.71 R35.2
N$25  (via drill 0.6)
  Top 0.254: v56.83,46.67 56.83,33.34 57.15,33.02 57.15,15.24 55.24,13.34 49.53,13.34 46.63,10.44 J8.TIP | v52.55,46.67 52.81,46.41 R35.1
  Bottom 0.254: v56.83,46.67 v52.55,46.67
N$26  (via drill 0.6)
  Top 0.254: IC7.6 6.67,35.08 7.46,34.29 21.91,34.29 v22.54,34.92 | IC8.5 17.46,32.23 17.78,32.54 22.23,32.54 22.54,32.23 v22.54,32.07
  Top 0.305: IC7.6 6.67,37.47 6.88,37.68 C40.1
  Bottom 0.254: v22.54,34.92 v22.54,32.07
N$27
  Top 0.254: IC7.7 5.4,34.92 5.08,34.61 3.81,34.61 3.49,34.29 3.49,33.34 3.17,33.02 3.17,25.4 5.4,23.18 11.11,23.18 12.7,24.77 14.92,24.77 | 14.92,24.77 18.73,24.77 20,26.04 R52.2 | 14.92,17.78 14.92,24.77
  Top 0.305: IC7.7 5.4,37.47 5.18,37.68 C40.2 | R61.1 14.92,17.78
N$28
  Top 0.254: IC6.1 IC6.2
N$29
  Top 0.254: 40.01,35.56 IC9.14 40.01,40.64 38.42,42.23 36.99,42.23 34.92,40.16 32.86,40.16 29.53,36.83 R36.P$2
N$43
  Top 0.254: R58.1 42.76,20.95 J3.SW
N$51  (via drill 0.6)
  Top 0.254: IC8.13 16.19,35.08 15.88,34.77 11.91,34.77 11.43,35.24 v11.11,35.24 | IC8.2 R50.2 R49.1 11.21,28.79 11.11,28.89 v11.11,31.11
  Bottom 0.254: v11.11,31.11 v11.11,35.24
N$56  (via drill 0.6)
  Top 0.406: JP6.2 JP6.1 | v51.44,70.17 D3.A
  Bottom 0.406: JP6.1 44.45,67.31 47.31,70.17 v51.44,70.17
N$64
  Top 0.305: P1.2 53.34,56.38 53.34,58.1 JP6.10
  Top 0.406: JP6.10 JP6.9
N$65
  Top 0.254: J1.TIP 2.86,20.99 2.86,22.54 1.27,24.13 1.27,33.66 1.59,33.97 1.59,42.86 2.86,44.13 2.86,53.02 6.67,56.83 R25.1
N$66
  Top 0.254: IC4.6 21.91,60.96 20.74,59.79 R23.1 C27.1 R24.2 R28.2
N$67
  Top 0.254: R28.1 16.19,56.52 13.65,53.98 4.76,53.98 3.49,52.7 3.49,43.81 2.22,42.55 2.22,33.66 1.91,33.34 1.91,24.77 4.13,22.54 4.13,14.29 1.27,11.43 1.27,4.76 1.91,4.13 5.08,4.13 6.03,3.17 9.84,3.17 10.16,2.86 19.37,2.86 20,3.49 23.5,3.49 24.13,2.86 33.02,2.86 33.34,3.17 41.27,3.17 42.55,4.45 42.55,11.75 46.63,15.84 J4.TIP
N$68
  Top 0.254: IC4.13 16.83,69.22 17.04,69.43 R18.1 18.1,70.48 18.95,71.33 C18.1 19.05,72.17 19.05,74.3 18.95,74.4 R12.2 R9.2
N$69
  Top 0.254: IC4.2 16.83,60.96 16.51,60.64 15.24,60.64 14.92,60.33 R22.1 C26.1 14.19,58.53 R26.2 R25.2
N$70
  Top 0.254: IC1.4 41.59,82.35 41.59,80.64 40.32,79.38 40.32,73.66 40.01,73.34 R17.1
N$71
  Top 0.254: R10.2 R13.2 C19.1 R19.1 21.27,70.27 21.27,69.85 21.91,69.22 IC4.9
N$72
  Top 0.254: IC1.3 40.96,82.36 40.96,80.96 39.69,79.69 39.69,74.3 38.42,73.03 R16.1
N$73
  Top 0.254: 40.01,69 R21.1 40.11,70.48 R17.2 C21.1
N$74
  Top 0.254: C20.1 R16.2 38.31,70.48 R20.1
N$75  (via drill 0.6)
  Top 0.254: IC9.7 R55.2 R56.1 47.52,28.47 47.94,28.89 v47.94,30 | IC9.12 42.55,35.08 42.86,34.77 47.31,34.77 47.78,35.24 v47.94,35.24
  Bottom 0.254: v47.94,30 v47.94,35.24
N$76
  Top 0.254: IC9.5 42.55,32.23 42.86,32.54 52.07,32.54 52.39,32.23 IC10.2 52.39,29.53 52.6,29.31 C52.1
N$77
  Top 0.254: IC9.2 38.73,29.53 39.05,29.21 R53.1 | R48.2 37.47,28.47 37.57,28.57 38.1,28.57 38.16,28.63 R53.1 | R53.1 R54.2
N$78
  Top 0.254: IC10.1 51.12,29.53 50.8,29.21 50.8,28.68 C52.2 50.9,28.04 49.53,26.67 46.67,26.67 | 46.67,26.67 46.67,26.04 45.4,24.77 41.59,24.77 40.64,25.72 R54.1 | 46.67,26.67 R56.2
N$79
  Top 0.254: IC8.4 16.19,32.38 16.03,32.54 5.71,32.54 5.4,32.23 IC7.2 C53.1
N$81
  Top 0.254: R55.1 43.5,28.36 C55.1
N$82
  Top 0.254: C51.1 R48.1
N$83
  Top 0.254: 12.06,25.4 10.48,23.81 7.3,23.81 5.4,25.72 C53.2 4.66,27.41 4.13,27.94 IC7.1 | 12.06,25.4 R49.2 | 12.06,25.4 17.78,25.4 18.41,26.04 R51.1
N$84
  Top 0.254: R52.1 R51.2 | R52.1 IC8.7 | R47.2 21.64,28.63 R52.1
N$85
  Top 0.254: 15.24,28.36 C54.1 15.04,28.47 R50.1
N$86
  Top 0.254: R47.1 C50.1
N$87
  Top 0.254: R61.2 15.03,6.35 J6.TIP
N$90
  Top 0.254: R5.1 41.91,94.51 41.91,94.93 41.59,95.25 36.35,95.25 34.88,93.78 UC1.32
N$93
  Top 0.254: R4.1 36.2,94.3 35.17,93.28 UC1.31
PWM_CUTOFF_1  (via drill 0.6)
  Top 0.254: R4.2 C6.1 39.05,92.77 39.05,92.08 43.18,87.95 43.18,76.83 46.35,73.66 46.35,70.17 43.81,67.63 43.81,64.77 42.23,63.18 v42.23,56.52 | IC8.3 14.92,29.84 15.24,29.53 16.83,29.53 | 16.83,29.53 18.41,29.53 18.73,29.84 IC8.6 | 16.83,29.53 16.83,28.42 17.46,27.78 20.8,27.78 21.11,27.46 24.92,27.46 v25.4,26.99 | v26.67,40.01 v29.21,40.01
  Bottom 0.254: v42.23,56.52 38.1,56.52 35.88,54.29 35.88,50.8 29.53,44.45 29.53,40.32 v29.21,40.01 | v25.4,26.99 25.72,27.3 25.72,31.43 25.4,31.75 25.4,38.73 v26.67,40.01
PWM_CUTOFF_2  (via drill 0.6)
  Top 0.254: R5.2 C7.1 40.32,92.77 40.32,91.76 43.81,88.27 43.81,77.15 46.99,73.98 46.99,69.85 44.45,67.31 44.45,64.45 42.86,62.87 42.86,58.1 43.81,57.15 43.81,55.56 47.62,51.75 v47.62,47.31 | IC9.6 43.81,29.84 43.5,29.53 42.07,29.53 | 42.07,29.53 40.32,29.53 40.01,29.84 IC9.3 | 42.07,29.53 v42.07,28.57
  Bottom 0.254: v47.62,47.31 47.62,46.35 45.09,43.81 45.09,32.54 42.07,29.53 v42.07,28.57
RESET  (via drill 0.6)
  Top 0.254: v22.86,101.6 23.18,101.92 40.01,101.92 40.32,102.23 46.99,102.23 47.94,103.19 JP7.10 | v27.3,94.3 27.3,93.03 27.05,92.78 UC1.7 | R1.1 23.6,96.2 v22.23,96.2
  Bottom 0.254: v27.3,94.3 25.4,96.2 v22.23,96.2 22.86,96.84 v22.86,101.6
SHAPE_1
  Top 0.254: UC1.12 25.19,90.28 24.45,89.53 24.45,86.52 20.8,82.87 15.88,82.87 13.65,85.09 13.65,86.68 12.86,87.47 10.64,87.47 10.16,87.95 R2.P$2
SHAPE_2
  Top 0.254: R3.P$2 48.9,100.97 49.53,101.6 49.53,105.09 48.58,106.05 42.23,106.05 39.37,103.19 17.78,103.19 12.38,97.79 12.38,94.93 14.13,93.19 14.13,85.41 16.19,83.34 20.48,83.34 23.97,86.84 23.97,90.01 24.74,90.78 UC1.11
SW_METER  (via drill 0.6)
  Top 0.254: SW3.4 SW3.3 | 30.09,96.59 UC1.42 30.09,96.27 v30.8,95.57
  Bottom 0.254: v30.8,95.57 31.43,94.93 31.43,93.98 31.43,86.04 32.23,85.25 32.23,73.82 32.78,73.27 SW3.3
SW_MODE_1
  Top 0.254: UC1.41 30.59,98.63 28.89,100.33 27.1,100.33 SW1.4 SW1.3
SW_MODE_2
  Top 0.254: SW2.4 SW2.3 31.09,99.4 UC1.40
VCA_CONTROL_1  (via drill 0.6)
  Top 0.254: C30.2 18.52,52.28 18.73,52.07 IC5.7 18.73,49.21 18.41,48.9 16.83,48.9 15.24,47.31 v14.61,47.31 | C30.2 18.73,53.24 | IC8.14 14.92,37.78 v15.56,38.42 | v19.05,54.29 18.52,53.76 C30.2 | v12.06,86.04 9.31,86.04 R6.2 9.21,87 8.26,87.95 4.76,87.95 TP1.P$1 | v23.81,52.7 32.07,52.7 | R27.P$1 32.07,50.17 32.07,52.7 | D5.C 31.11,63.36 31.11,54.61 32.07,53.66 32.07,52.7
  Bottom 0.254: v12.06,86.04 14.13,83.98 14.13,75.09 13.02,73.98 13.02,72.39 15.88,69.53 15.88,60.96 19.05,57.78 v19.05,54.29 20.64,52.7 v23.81,52.7 | v14.61,47.31 14.61,46.04 16.19,44.45 16.19,40.64 16.51,40.32 16.51,39.37 v15.56,38.42
VCA_CONTROL_2  (via drill 0.6)
  Top 0.254: IC6.7 39.05,51.75 38.84,51.97 C31.2 38.73,52.81 v38.73,54.93 38.73,59.69 36.51,61.91 v34.61,61.91 | IC9.11 43.81,37.47 43.5,37.78 v43.5,38.42 | v33.34,46.04 35.56,46.04 36.83,47.31 v38.73,47.31 | D4.C v34.61,66.67 34.92,66.99 34.92,73.98 33.02,75.88 26.67,75.88 22.23,80.33 9.31,80.33 R7.2 9.21,79.69 8.26,78.74 TP2.P$1
  Bottom 0.254: v34.61,61.91 v34.61,66.67 | v33.34,46.04 31.11,43.81 31.11,38.1 32.03,37.19 R36.P$1 | v43.5,38.42 43.5,40.96 38.73,45.72 v38.73,47.31 v38.73,54.93
VCC  (via drill 0.6)
  Top 0.254: v29.84,26.99 R57.1 | 30.16,33.81 33.97,33.81 | 33.97,33.81 34.92,33.81 | 34.92,33.81 v54.45,33.81 | v51.12,38.26 IC10.8 50.44,36.26 C45.1 | v6.19,34.29 6.67,33.81 | v9.21,36.51 10.69,38 | 10.69,38 C41.1 | IC8.16 12.12,36.51 12.06,36.51 10.69,37.88 10.69,38 | 30.16,33.81 | 30.16,33.81 v30.16,33.02 | 36.55,50.54 36.51,50.5 v36.51,49.21 | 33.97,33.81 v33.97,34.29 | IC6.8 37.74,50.59 C32.1 | 34.92,33.81 34.92,35.03 C46.1 36.15,36.26 IC9.16 | 6.67,33.81 | 6.67,33.81 30.16,33.81 | 57.47,62.87 57.47,67.63 | 57.47,67.63 57.47,68.58 57.15,68.9 D3.C | C24.+ 56.22,67.63 57.47,67.63
  Top 0.305: IC7.8 4.13,38.42 | 4.13,38.42 4.13,39.37 4.23,39.47 C35.1 | 4.13,38.42 v3.81,38.42 | v55.88,41.27 55.88,47.31 56.52,47.94 56.52,50.8 57.47,51.75 57.47,62.87 | IC5.8 17.46,51.75 17.14,52.07 C29.1 17.04,52.7 16.51,52.7 v15.88,53.34 | v20,47.62 20.64,47.62 21.59,48.58 33.66,48.58 35.66,50.59 C32.1 36.55,50.54 | 57.16,70.15 57.12,70.11
  Top 0.406: IC8.16 12.32,36.2 | 57.16,70.15 D3.C 57.15,74.61 57.3,74.76 R11.1
  Bottom 0.254: v30.16,33.02 29.84,32.7 v29.84,26.99 | v51.12,38.26 51.12,34.61 51.91,33.81 v54.45,33.81 55.09,33.81 55.88,34.61 v55.88,41.27 | v3.81,38.42 3.81,36.2 5.71,34.29 v6.19,34.29 6.99,34.29 v9.21,36.51 | v36.51,49.21 36.51,47.94 31.75,43.18 31.75,38.73 33.97,36.51 v33.97,34.29
  Bottom 0.305: v20,47.62 20,50.48 17.14,53.34 v15.88,53.34
VEE  (via drill 0.6)
  Top 0.254: v56.2,32.7 53.18,32.7 52.7,33.18 32.23,33.18 31.43,32.38 R46.1 29.95,31.65 28.42,33.18 24.13,33.18 | IC9.9 46.41,36.2 46.67,36.2 v47.94,37.47 48.05,37.57 C39.2 | v4.6,33.18 24.13,33.18 | 24.13,33.18 v24.13,30.8 | v23.81,46.35 22.76,46.35 C33.2 21.49,46.57 21.27,46.35 | v23.18,36.83 22.33,37.68 C44.2 22.33,37.57 21.27,36.51 IC8.9 | 21.27,46.35 21.27,47.31 21.91,47.94 36.51,47.94 37.15,48.58 39.37,48.58 40.32,47.62 42.55,47.62 42.86,47.31 C34.2 42.76,46.67 41.59,46.67 IC6.4 | 21.27,46.35 IC5.4 | v9.21,30.8 9.74,30.27 C49.2 9.74,29 7.94,30.8 IC7.4
  Top 0.305: 54.99,31.11 IC10.4 56,31.05 C48.2 v56.2,32.7 56.2,39.37 54.93,40.64 54.93,41.91 55.24,42.23 55.24,47.94 55.88,48.58 55.88,51.44 56.2,51.75 C28.- 56.19,53.02 51.75,53.02 50.35,54.42 P1.1 D6.A
  Bottom 0.254: v47.94,37.47 49.21,37.47 50.48,36.2 50.48,34.29 52.07,32.7 v56.2,32.7 | v4.6,33.18 6.99,30.8 v9.21,30.8 | v23.81,46.35 23.5,46.35 22.54,45.4 22.54,37.47 v23.18,36.83 24.13,35.88 v24.13,30.8

### Text on the board
tPlace: TP1 | TP2
bPlace: Red stripe
tNames: cc-by-sa Émilie Gillet, 2014. v0.5 | Streams
bNames: Streams | cc-by-sa Émilie Gillet, 2014. v0.5 | +12V | GND | -12V